# EasyEDA Pro project ProDocument_BFMC_Power Board V3_Final.epro

# Schematic Balance_batt_protection_SolidState_5

## Sheets
1 Balance_batt_protection_SolidState: Board Name: greater0603 Dsample; Create Date: 2024-08-29; Page Name: Balance_batt_protection_SolidState; Project Name: BFMC_Power Board V2; Schematic Name: Balance_batt_protection_SolidState_3; Update Date: 2024-08-30
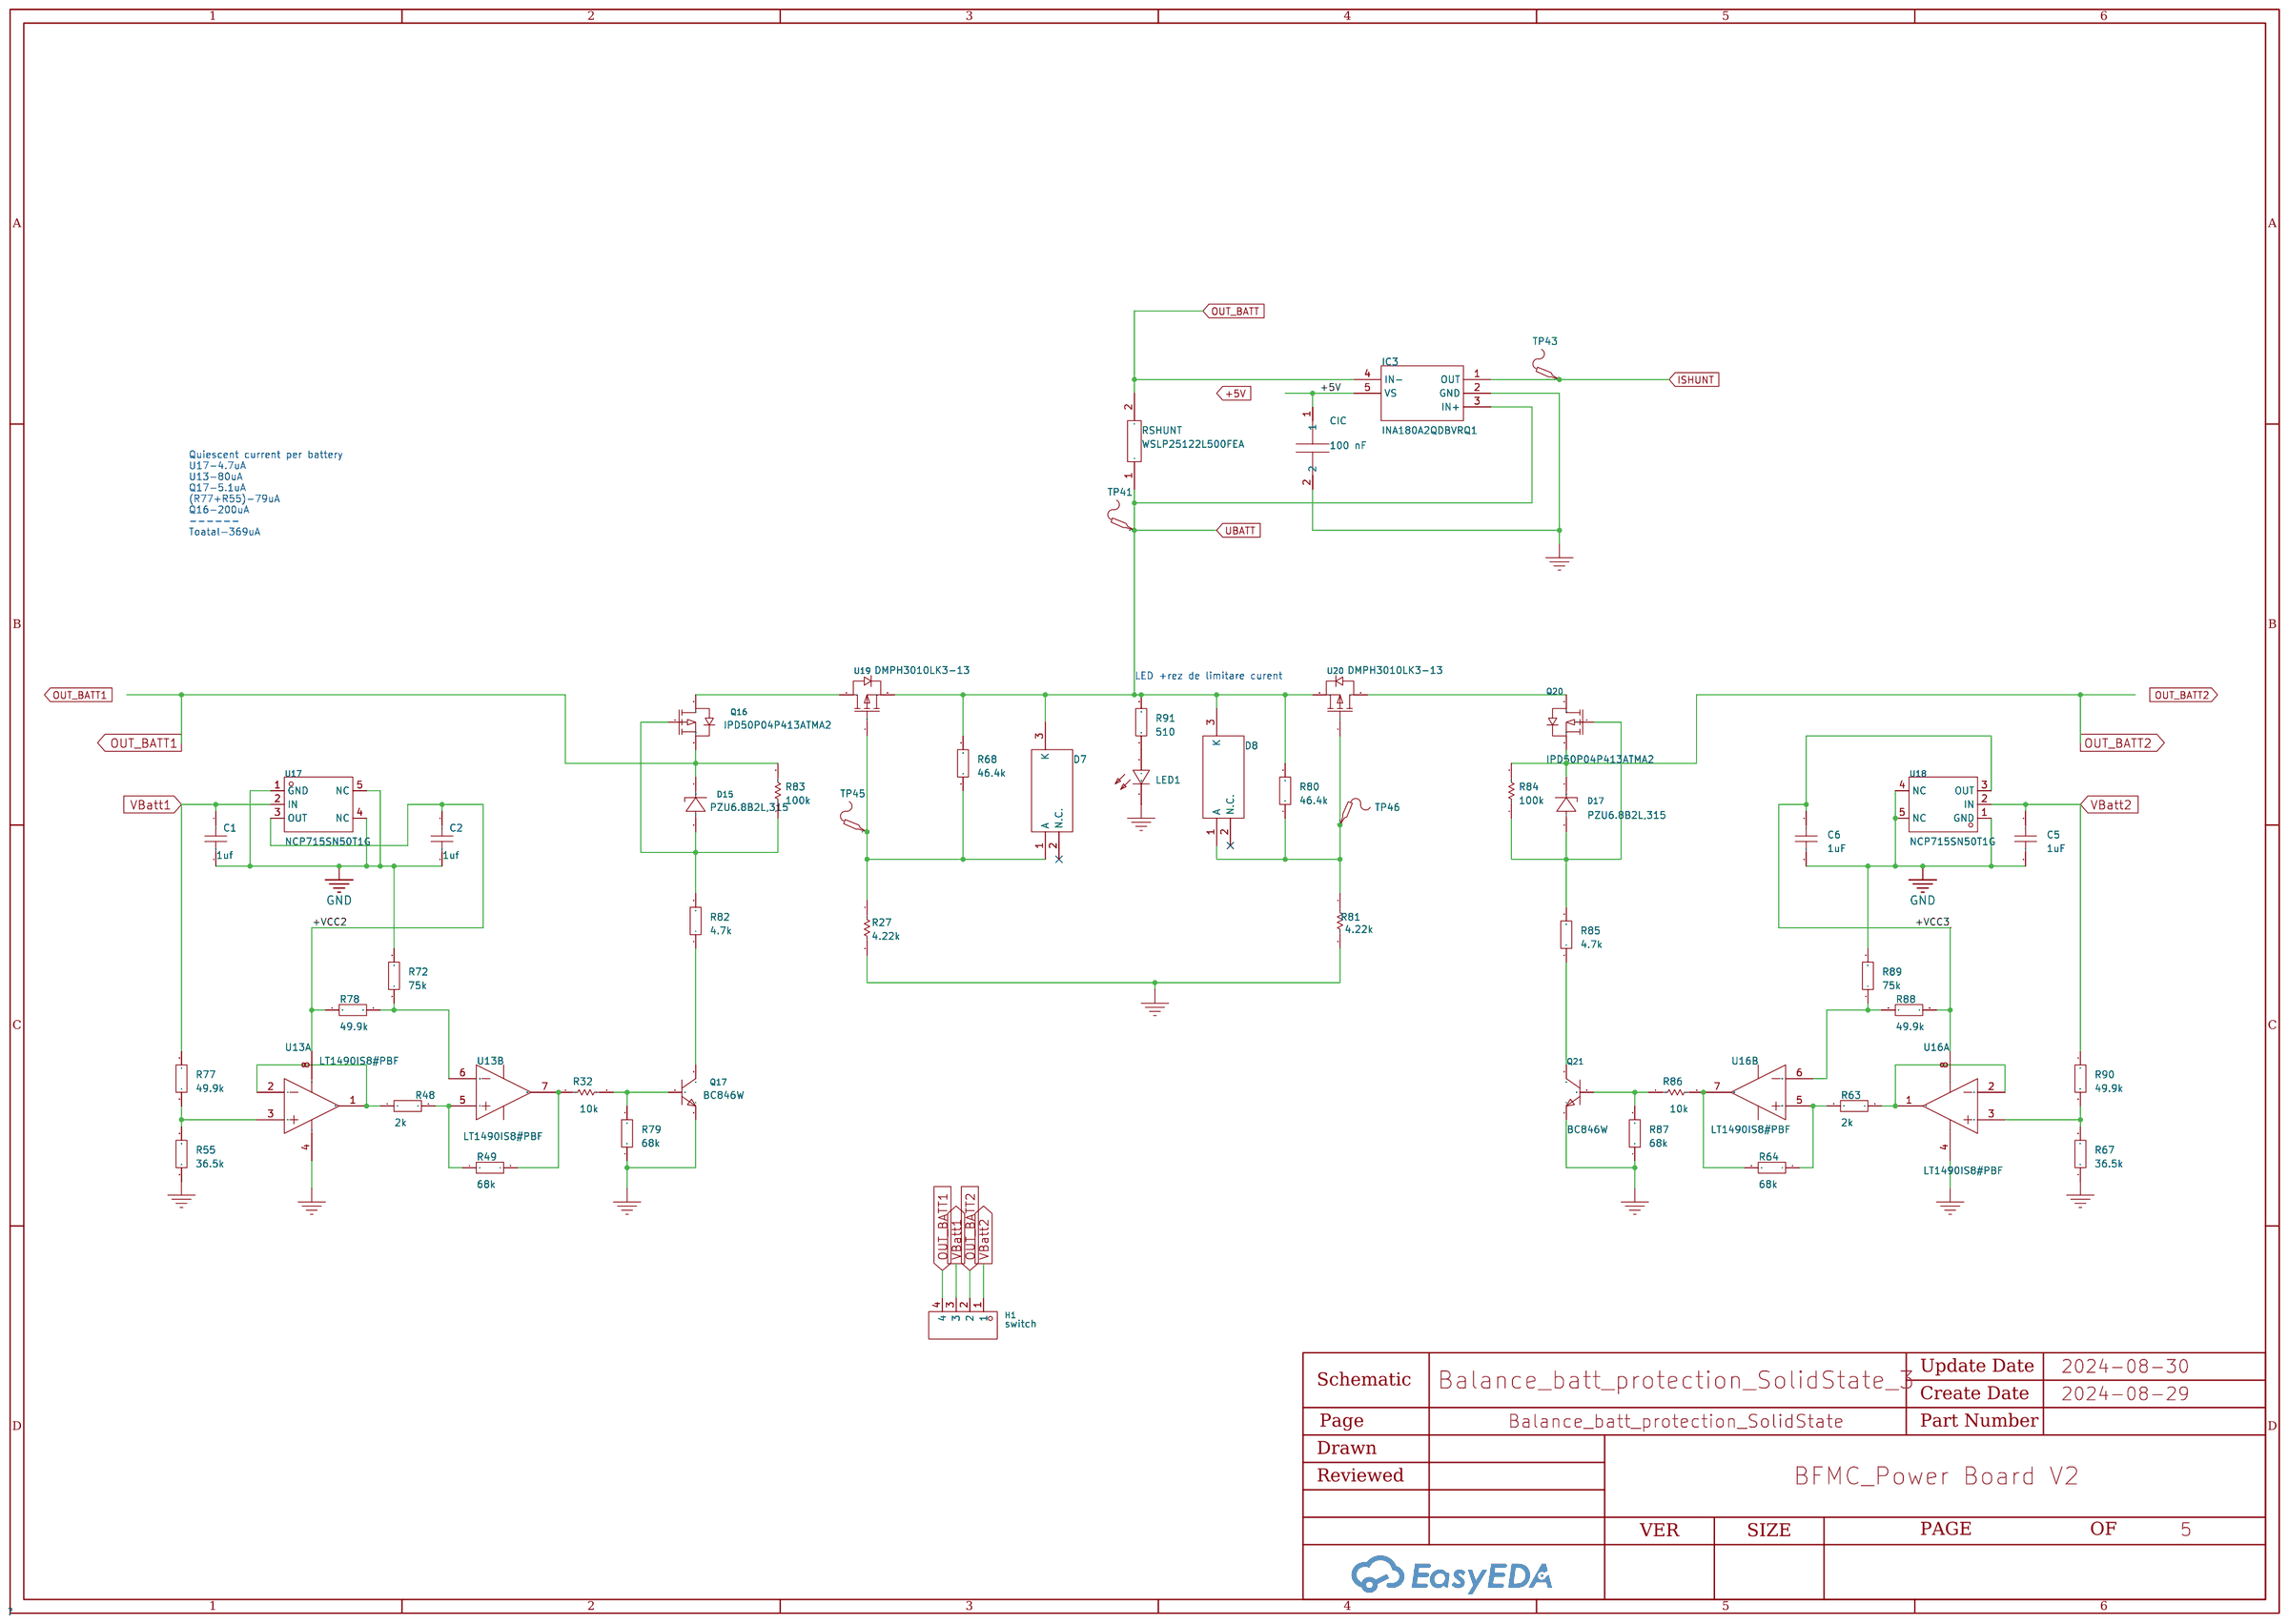
[diagram p0: Balance_batt_protection_SolidState]
2 PWR_Board: Page Name: PWR_Board
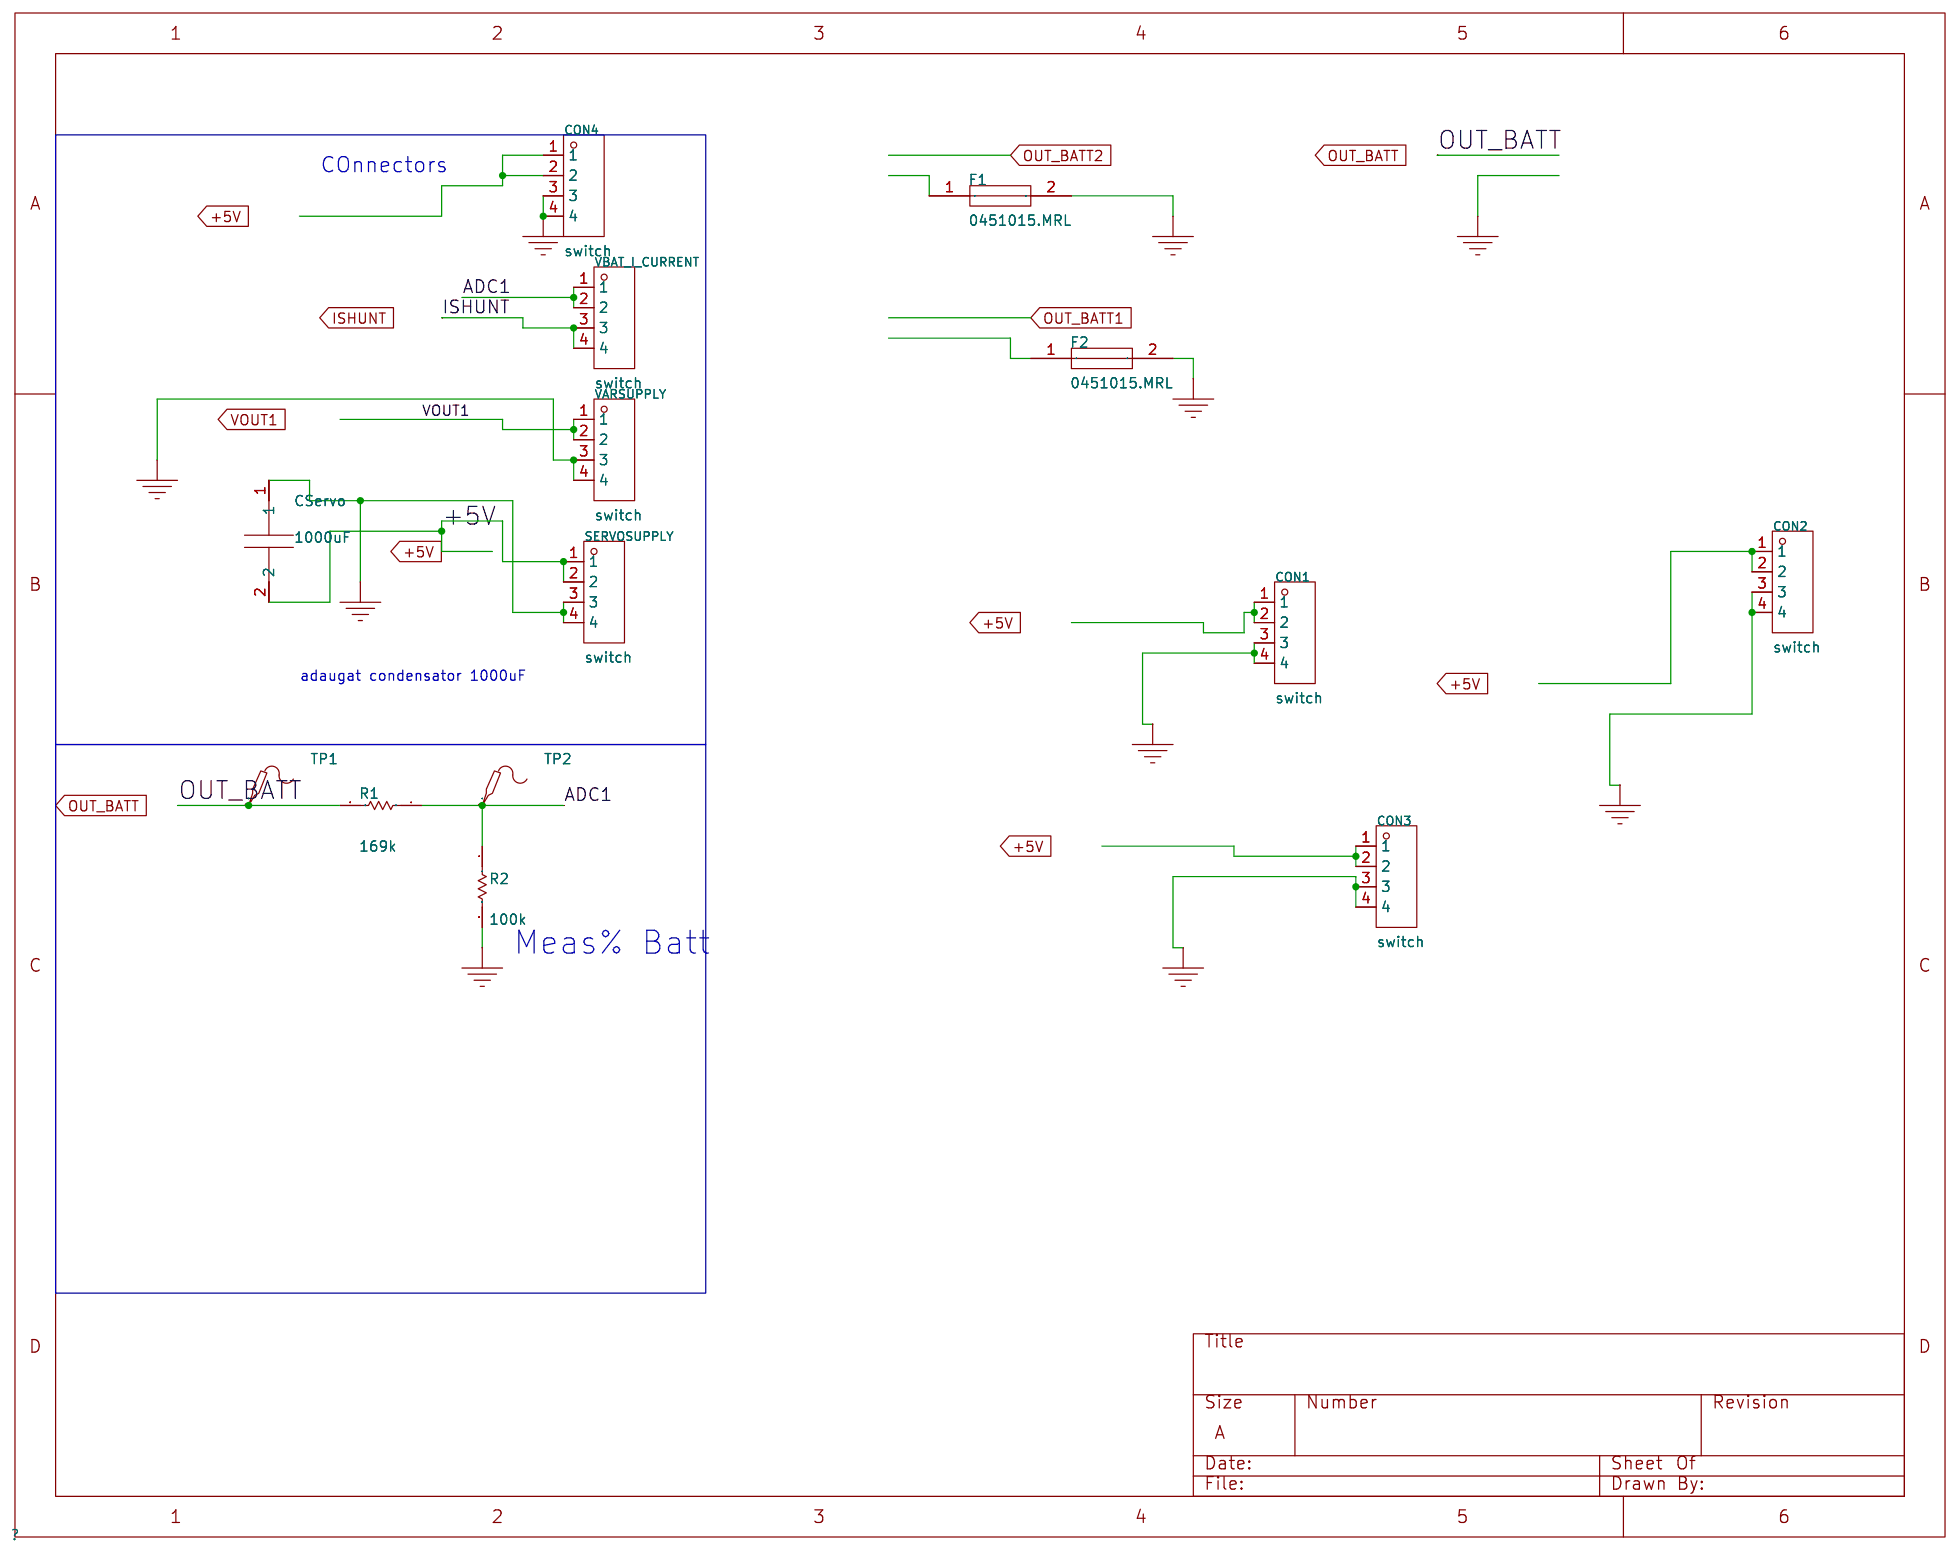
[diagram p1: PWR_Board]
3 bOOST cONVERTER
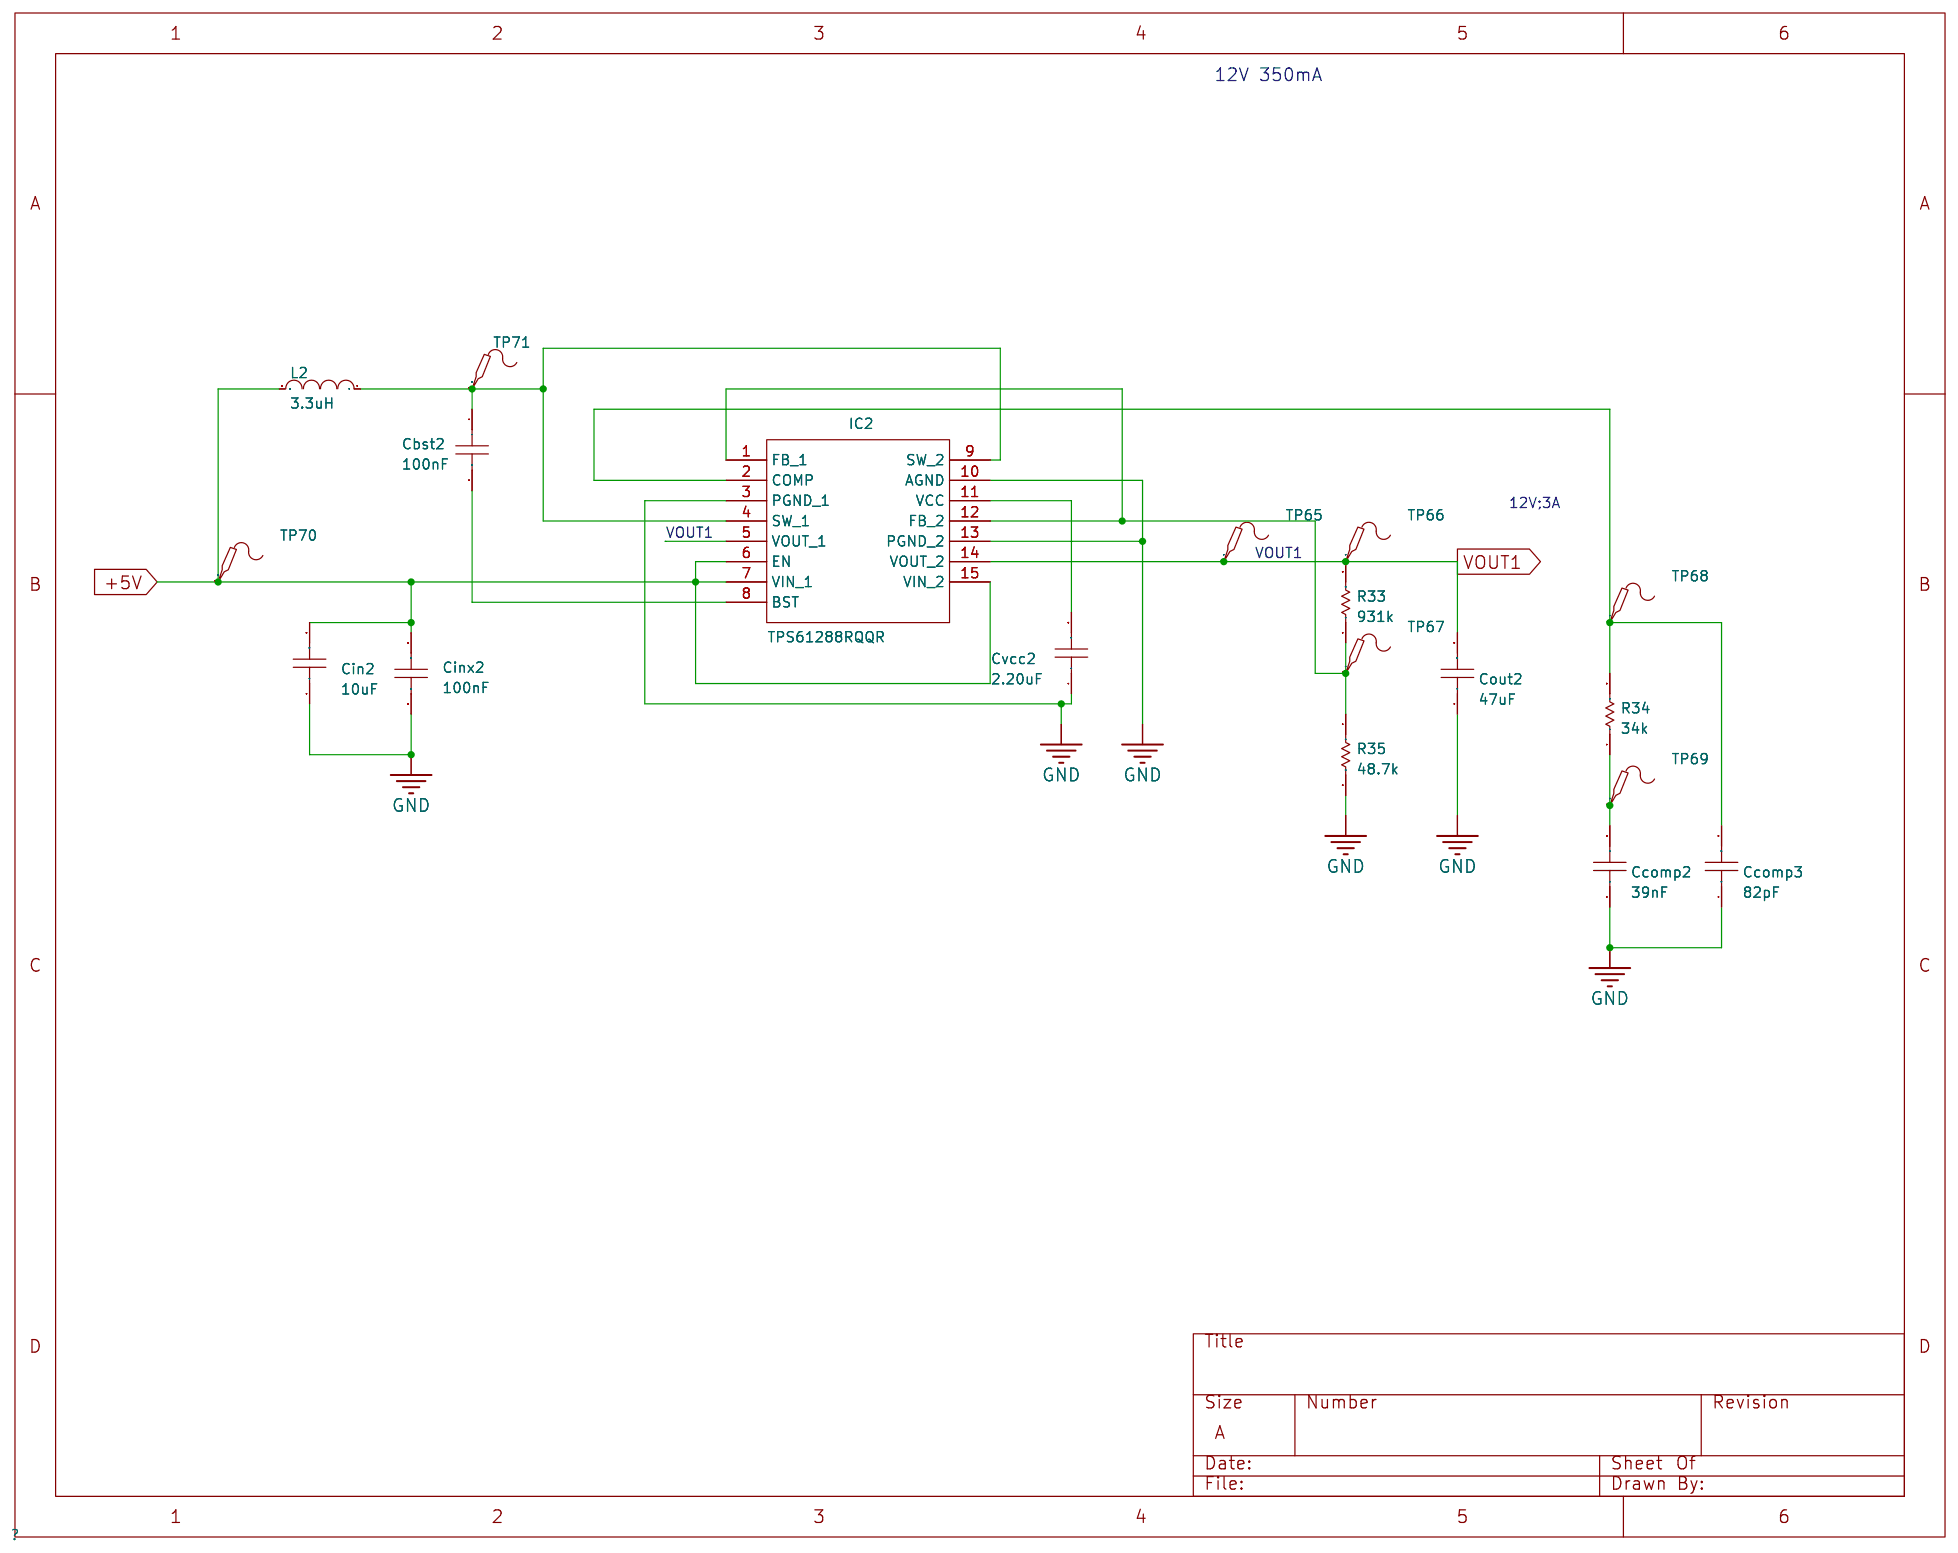
[diagram p2: bOOST cONVERTER]
4 buck_converter15A-5V: Page Name: buck_converter15A-5V; Update Date: 2024-08-29
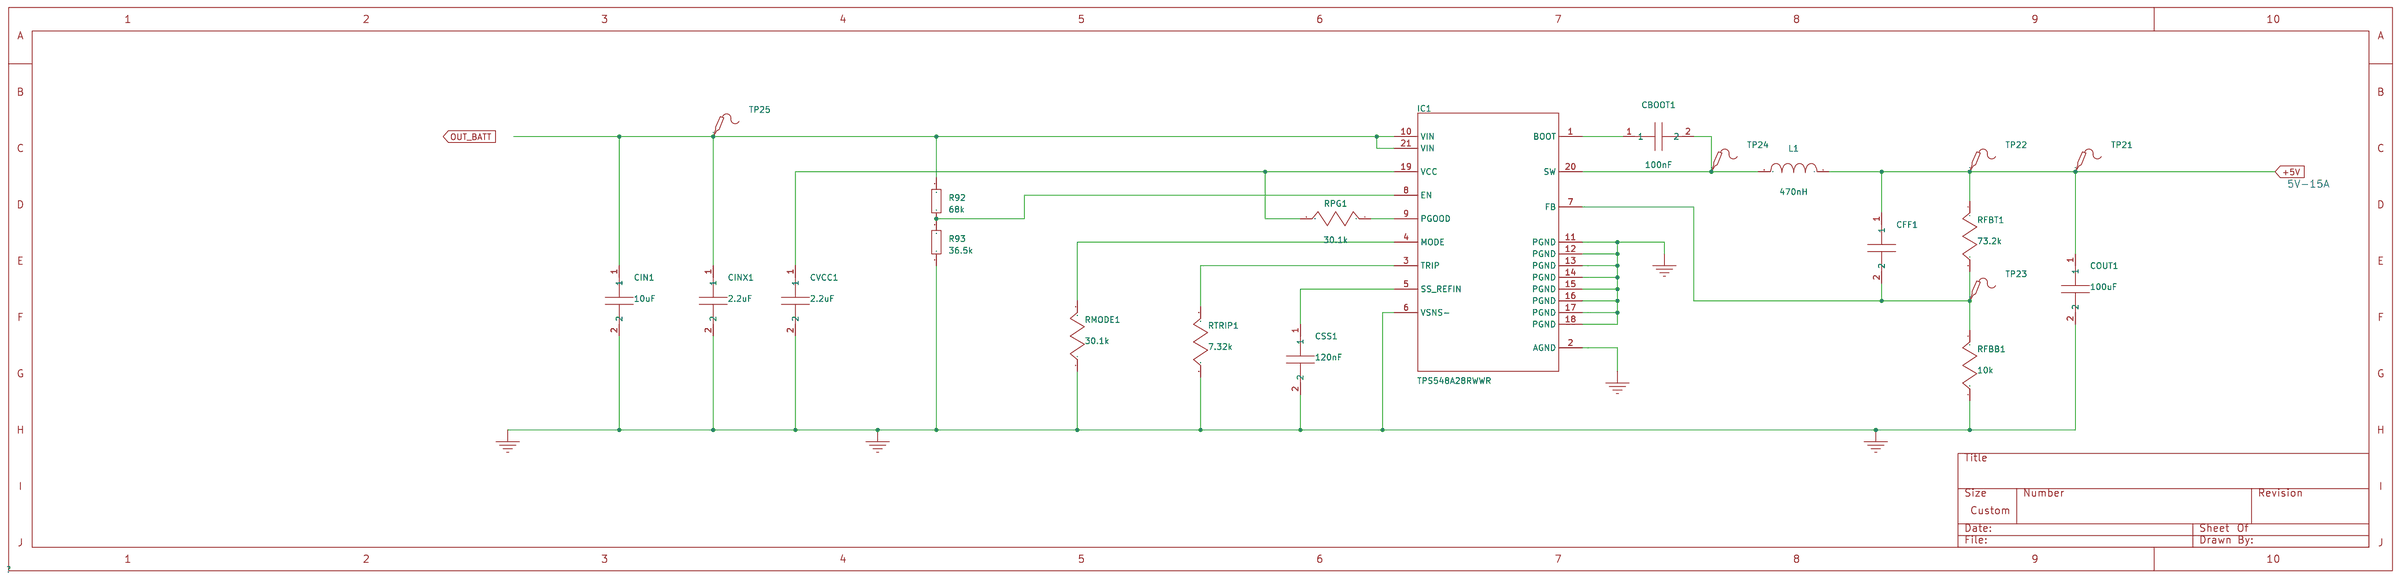
[diagram p3: buck_converter15A-5V]

## Parts
sheet Balance_batt_protection_SolidState
C1  1uf  [C9]
C2  1uf  [C9]
C5  1uF  [C9]
C6  1uF  [C9]
CIC  100 nF  [Cbst2]
D7  SZBZX84C18ET1G  [SZBZX84C18ET1G]
D8  SZBZX84C18ET1G  [SZBZX84C18ET1G]
D15  PZU6.8B2L,315  [DFN1006-2L-RD]
D17  PZU6.8B2L,315  [DFN1006-2L-RD]
H1  switch  [M2021BB1W01]
IC3  INA180A2QDBVRQ1  [INA180A2QDBVRQ1]
LED1  ASCKCG00-NW5X5020302  [LEDGREEN]
Q16  IPD50P04P413ATMA2  [PG-TO252-3_L6.3-W6.5-P4.57-LS10.0-BR-CW]
Q17  BC846W  [SOT-323-3_L2.2-W1.3-P1.30-LS2.2-BR]
Q20  IPD50P04P413ATMA2  [PG-TO252-3_L6.3-W6.5-P4.57-LS10.0-BR-CW]
Q21  BC846W  [SOT-323-3_L2.2-W1.3-P1.30-LS2.2-BR]
R27  4.22k  [R0805_NEW]
R32  10k  [R0603]
R48  2k  [R35]
R49  68k  [R0603]
R55  36.5k  [R0603]
R63  2k  [R35]
R64  68k  [R0603]
R67  36.5k  [R0603]
R68  46.4k  [R0603]
R72  75k  [R0603]
R77  49.9k  [R0603]
R78  49.9k  [R0603]
R79  68k  [R0603]
R80  46.4k  [R0603]
R81  4.22k  [R0805_NEW]
R82  4.7k  [R0603]
R83  100k  [R0603]
R84  100k  [R0603]
R85  4.7k  [R0603]
R86  10k  [R0603]
R87  68k  [R0603]
R88  49.9k  [R0603]
R89  75k  [R0603]
R90  49.9k  [R0603]
R91  510  [R0805_NEW]
RSHUNT  WSLP25122L500FEA  [WSLP25122L000FEA BUN]
TP41  -  [Test-Point-0.5mm]
TP43  -  [Test-Point-0.5mm]
TP45  -  [Test-Point-0.5mm]
TP46  -  [Test-Point-0.5mm]
U13  LT1490IS8#PBF  [SO-8_L4.9-W3.9-P1.27-LS5.9-BL]  (sections 1,2)
U16  LT1490IS8#PBF  [SO-8_L4.9-W3.9-P1.27-LS5.9-BL]  (sections 1,2)
U17  NCP715SN50T1G  [TSOP-5_L3.0-W1.5-P0.95-BL]
U18  NCP715SN50T1G  [TSOP-5_L3.0-W1.5-P0.95-BL]
U19  DMPH3010LK3-13  [PG-TO252-3_L6.3-W6.5-P4.57-LS10.0-BR-CW]
U20  DMPH3010LK3-13  [PG-TO252-3_L6.3-W6.5-P4.57-LS10.0-BR-CW]
sheet bOOST cONVERTER
Cbst2  100nF  [Cbst2]
Ccomp2  39nF  [0603 0.5x0.8]
Ccomp3  82pF  [Cbst2]
Cin2  10uF  [C0805]
Cinx2  100nF  [Cbst2]
Cout2  47uF  [C1210]
Cvcc2  2.20uF  [C0603]
IC2  TPS61288RQQR  [TPS61288RQQR]
L2  3.3uH  [DR127-3R3-R (L2)]
R33  931k  [R0603]
R34  34k  [R0603]
R35  48.7k  [R35]
TP65  -  [Test-Point-0.5mm]
TP66  -  [Test-Point-0.5mm]
TP67  -  [Test-Point-0.5mm]
TP68  -  [Test-Point-0.5mm]
TP69  -  [Test-Point-0.5mm]
TP70  -  [Test-Point-0.5mm]
TP71  -  [Test-Point-0.5mm]
sheet buck_converter15A-5V
CBOOT1  100nF  [Cbst2]
CFF1  C1005C0G1H220J  [0603 0.5x0.8]
CIN1  10uF  [Cin1 Aditome]
CINX1  2.2uF  [C0603]
COUT1  100uF  [C1210]
CSS1  120nF  [0603 0.5x0.8]
CVCC1  2.2uF  [C0603]
IC1  Value  [TPS548B28RWWR]
L1  470nH  [IHLP4040DZERR47M11]
R92  68k  [R0603]
R93  36.5k  [R0603]
RFBB1  10k  [0805 dany2]
RFBT1  73.2k  [0603 0.5x0.8]
RMODE1  30.1k  [1206R aditome]
RPG1  30.1k  [1206R aditome]
RTRIP1  7.32k  [Rtrip]
TP21  -  [Test-Point-0.5mm]
TP22  -  [Test-Point-0.5mm]
TP23  -  [Test-Point-0.5mm]
TP24  -  [Test-Point-0.5mm]
TP25  -  [Test-Point-0.5mm]
sheet PWR_Board
CON1  switch  [new connector]
CON2  switch  [new connector]
CON3  switch  [new connector]
CON4  switch  [new connector]
CServo  1000uF  [CAPAE1030X1050N]
F1  0451015.MRL  [FUSC6127X294N]
F2  0451015.MRL  [FUSC6127X294N]
R1  169k  [R0805_NEW]
R2  100k  [R0603]
SERVOSUPPLY  switch  [new connector]
TP1  -  [Test-Point-0.5mm]
TP2  -  [Test-Point-0.5mm]
VARSUPPLY  switch  [new connector]
VBAT_I_CURRENT  switch  [new connector]

## Library data of the parts
C1 C2 C5 C6 Cbst2 Ccomp2 Ccomp3 Cin2 Cinx2 Cout2 Cvcc2 = CAP_0201: Supplier Footprint: 0201
CIC = C2012X7S1C106K: C3216X6S1V106K16; PackageReference: C3216X6S1V106K160AC; Manufacturer Part Number: C3216X6S1V106K160AC; Manufacturer Name: TDK; Design Item ID: C3216X6S1V106K160AC; Library Name: TI WEBENCH
D7 D8 = SZBZX84C18ET1G: Zener Diode; Datasheet Link: https://assets.nexperia.com/documents/data-sheet/BZX84W_SER.pdf; Height: 1.1mm; Manufacturer_Name: Nexperia; Manufacturer_Part_Number: BZX84W-C15F; Mouser Part Number: 771-BZX84W-C15F; Mouser Price/Stock: https://www.mouser.co.uk/ProductDetail/Nexperia/BZX84W-C15F?qs=MLItCLRbWsyz6DhKLlcnOA%3D%3D; Arrow Part Number: BZX84W-C15F; Arrow Price/Stock: https://www.arrow.com/en/products/bzx84w-c15f/nexperia; Origin Footprint 2: SOT65P210X110-3N; Origin Footprint 3: SOT65P210X110-3N; Origin Footprint 1: SOT95P230X110-3N; Design Item ID: BZX84W-C15F; Library Name: BZX84(sot 23)
D15 D17 = PZU6.8B2L,315: Diode Configuration:Single Zener Voltage (Nom):6.8V Reverse Leakage Current (Ir):500nA@3.5V Zener Voltage (Range):6.65V~6.93V Zener Voltage (Range):6.65V~6.93V Power Dissipation:250mW Zener Impedance (Zzt):20Ω Tolerance:±2% Tolerance:±2%; Supplier Part: C553776; Manufacturer: Nexperia(安世); Supplier Footprint: DFN1006-2; JLCPCB Part Class: Extended Part; Datasheet: https://atta.szlcsc.com/upload/public/pdf/source/20200610/C553572_FAFAAE2347EA3EDE919A1362DDDB97BE.pdf; Supplier: LCSC; Diode Configuration: Single; Zener Voltage (Nom): 6.8V; Reverse Leakage Current (Ir): 500nA@3.5V; Zener Voltage (Range): 6.65V~6.93V; Power Dissipation: 250mW; Zener Impedance (Zzt): 20Ω; Tolerance: ±2%
CON1-CON4 H1 SERVOSUPPLY VARSUPPLY VBAT_I_CURRENT = HDR-F_2.54_1x4P: Supplier Footprint: Through
IC3 = INA180A2QDBVRQ1: Attenuator or Isolator; Datasheet Link: http://www.ti.com/lit/gpn/INA180-Q1; Height: 1.45mm; Manufacturer_Name: Texas Instruments; Mouser Part Number: 595-INA180A2QDBVRQ1; Mouser Price/Stock: https://www.mouser.co.uk/ProductDetail/Texas-Instruments/INA180A2QDBVRQ1?qs=9r4v7xj2LnnPs8OEye75UA%3D%3D; Arrow Price/Stock: https://www.arrow.com/en/products/ina180a2qdbvrq1/texas-instruments?region=nac; Origin Footprint 2: SOT95P280X145-5N; Origin Footprint 1: SOT95P280X145-5N
LED1 = 19-213/Y2C-CQ2R2L/3T(CY): Emitted Color:Yellow Power Dissipation:60mW Forward Current:20mA Dominant Wavelength:585.5nm~591.5nm Dominant Wavelength:585.5nm~591.5nm Peak Wavelength:591nm Diode Configuration:- Lens Color:无色透明透镜 Color Temperature:- Color Temperature:- Viewing Angle:12; LCSC Part Name: 黄灯; Supplier Part: C72038; Manufacturer: EVERLIGHT(亿光); Supplier Footprint: 0603; JLCPCB Part Class: Basic Part; Datasheet: https://atta.szlcsc.com/upload/public/pdf/source/20160507/1462613613586.pdf; Supplier: LCSC; Emitted Color: Yellow; Power Dissipation: 60mW; Forward Current: 20mA; Dominant Wavelength: 585.5nm~591.5nm; Peak Wavelength: 591nm; Lens Color: 无色透明透镜; Viewing Angle: 120°; Operating Temperature: -40℃~+85℃
Q16 Q20 = IPD50P04P4-13: Type: Drain Source Voltage (Vdss):- Continuous Drain Current (Id):- Power Dissipation (Pd):- Drain Source On Resistance (RDS(on)@Vgs,Id):- Gate Threshold Voltage (Vgs(th)@Id):- Total Gate Charge (Qg@Vgs):- Input Capacitance (Ciss@Vds):- Reverse Transfer C; Supplier Part: C536783; Manufacturer: Infineon(英飞凌); Supplier Footprint: TO-252-3; JLCPCB Part Class: Extended Part; Datasheet: https://atta.szlcsc.com/upload/public/pdf/source/20200522/C536783_09FA5EF647CCDC43F05EF5A053B0ED62.pdf; Supplier: LCSC
Q17 Q21 = BC846W: Supplier Part: C2885597; Manufacturer: CJ(江苏长电/长晶); Supplier Footprint: SOT-323-3; JLCPCB Part Class: Extended Part; Datasheet: https://atta.szlcsc.com/upload/public/pdf/source/20210816/C7091E37381F16E73D159A80C307E9BF.pdf; Supplier: LCSC
R27 R81 = MCR03..PFX1002: Resistor; Published: 8-Jun-2000; LatestRevisionDate: 17-Jul-2002; LatestRevisionNote: Re-released for DXP Platform.; PackageReference: AXIAL-0.3; Publisher: Altium Limited; PackageDescription: Axial Device, Thru-Hole; 2 Leads; 0.3 in Pin Spacing; Origin Footprint 2: AXIAL-0.3; Origin Footprint 1: ERJP06D1000V; Design Item ID: Res1; Library Name: Miscellaneous Devices
R32-R35 R83 R84 R86 = MCR03..PFX1002: Resistor; Published: 8-Jun-2000; LatestRevisionDate: 17-Jul-2002; LatestRevisionNote: Re-released for DXP Platform.; PackageReference: AXIAL-0.3; Publisher: Altium Limited; PackageDescription: Axial Device, Thru-Hole; 2 Leads; 0.3 in Pin Spacing; Origin Footprint 2: AXIAL-0.3; Origin Footprint 1: RESC1608X55N; Design Item ID: Res1; Library Name: Miscellaneous Devices
R48 R49 R55 R63 R64 R67 R68 R72 R77-R80 R82 R85 R87-R93 = Res_0603: Supplier Footprint: 0603
RSHUNT = WSLP25122L500FEA: Resistor; Datasheet Link: https://componentsearchengine.com/Datasheets/1/WSLP25122L500FEA.pdf; Height: 0.889mm; Manufacturer_Name: Vishay; Mouser Part Number: 71-WSLP25122L500FEA; Mouser Price/Stock: https://www.mouser.co.uk/ProductDetail/Vishay-Dale/WSLP25122L500FEA?qs=%2FCXICPRLKg%252BpcyljWM%2FHhA%3D%3D; Arrow Price/Stock: https://www.arrow.com/en/products/wslp25122l500fea/vishay; Origin Footprint 2: RESC6432X89N; Origin Footprint 1: RESC6432X89N; Library Name: WSLP25122L000FEA
TP1 TP2 TP21-TP25 TP41 TP43 TP45 TP46 TP65-TP71 = Test-Point: Test Point 测试点
U13 U16 = LT1490IS8#PBF: Number of Circuits:双路 Gain Bandwidth Product(GBP):200kHz Current - Input Bias(Ib):4nA Slew Rate(SR):0.07V/us Output Current:25mA -3db Bandwidth:- Output Type:- Rail to Rail:- Operating Temperature:-40℃~+85℃ Operating Temperature:-40℃~+85℃; Supplier Part: C664003; Manufacturer: ADI(亚德诺); Supplier Footprint: SO-8; JLCPCB Part Class: Extended Part; Datasheet: https://atta.szlcsc.com/upload/public/pdf/source/20200911/C663998_10A639210BD1A12FE99FCEB2BDE120AA.pdf; Supplier: LCSC; Number of Circuits: 双路; Gain Bandwidth Product(GBP): 200kHz; Current - Input Bias(Ib): 4nA; Slew Rate(SR): 0.07V/us; Output Current: 25mA; Operating Temperature: -40℃~+85℃
U17 U18 = NCP715SN50T1G: LCSC Part Name: LDO Regulator, 50 mA, Ultra-Low Iq; Supplier Part: C892746; Manufacturer: onsemi(安森美); Supplier Footprint: TSOP-5-1.5mm; JLCPCB Part Class: Extended Part; Datasheet: https://atta.szlcsc.com/upload/public/pdf/source/20210820/E9CE8331E60FC76A82F78D41C3EC7928.pdf; Supplier: LCSC
U19 U20 = DMPH3010LK3-13: Drain Source Voltage (Vdss): Drain Source On Resistance (RDS(on)@Vgs,Id):7.5mΩ Input Capacitance (Ciss@Vds):6807pF@15V; LCSC Part Name: 耐压:30V; Supplier Part: C5245399; Manufacturer: DIODES(美台); Supplier Footprint: TO-252(DPAK); Datasheet: https://atta.szlcsc.com/upload/public/pdf/source/20230810/7575F8349A3E3E974B58F51814AB80C1.pdf; Supplier: LCSC; Drain Source On Resistance (RDS(on)@Vgs,Id): 7.5mΩ; Input Capacitance (Ciss@Vds): 6807pF@15V
IC2 = TPS61288RQQR
L2 = L_0402: Supplier Footprint: L0402
CBOOT1 = EMK105 B7104KVHF: EMK107B7104KA-T; PackageReference: EMK107B7104KA-T; Manufacturer Part Number: EMK107B7104KA-T; Manufacturer Name: Taiyo Yuden; Design Item ID: EMK107B7104KA-T; Library Name: TI WEBENCH
CFF1 = C1005C0G1H220J: C0402C240J3GACTU; PackageReference: C0402C240J3GACTU; Manufacturer Part Number: C0402C240J3GACTU; Manufacturer Name: Kemet; C1005C0G1H220J: 22pF; Design Item ID: C0402C240J3GACTU; Library Name: TI WEBENCH
CIN1 = GCJ31CC71E106K: GRM31CR71E106KA1; PackageReference: GRM31CR71E106KA12L; Manufacturer Part Number: GRM31CR71E106KA12L; Manufacturer Name: MuRata; Design Item ID: GRM31CR71E106KA12L; Library Name: TI WEBENCH
CINX1 CServo = GCM188C71A225K: C1608X7R1A225K08; PackageReference: C1608X7R1A225K080AC; Manufacturer Part Number: C1608X7R1A225K080AC; Manufacturer Name: TDK; Design Item ID: C1608X7R1A225K080AC; Library Name: TI WEBENCH
COUT1 = EMK325ABJ107MM-T: CUSTOM1; PackageReference: CUSTOM; Manufacturer Part Number: GENERIC_CAPACITOR; Manufacturer Name: CUSTOM; Design Item ID: GENERIC_CAPACITOR; Library Name: TI WEBENCH
CSS1 = C1608X7R1H154K: GRM155R61A124KE1; PackageReference: GRM155R61A124KE19D; Manufacturer Part Number: GRM155R61A124KE19D; Manufacturer Name: MuRata; Design Item ID: GRM155R61A124KE19D; Library Name: TI WEBENCH
CVCC1 = GCM188C71A225K: GRM188R71A225KE1; PackageReference: GRM188R71A225KE15D; Manufacturer Part Number: GRM188R71A225KE15D; Manufacturer Name: MuRata; Design Item ID: GRM188R71A225KE15D; Library Name: TI WEBENCH
IC1 = TPS548A28RWWR: No Description Available; Manufacturer: Texas Instruments; TYPE: TYPE; Manufacturer_Name: Texas Instruments; Copyright: Copyright (C) 2018 Accelerated Designs. All rights reserved; Library Name: TPS548B(vqfn-hr-21)
L1 = IHLP4040DZERR47M11: IHLP4040DZERR47M; Manufacturer Name: Vishay-Dale; Origin Footprint 2: INDPM108102X400N; Library Name: TI WEBENCH
RFBB1 = SMM0204 50 10K 1 %: CRCW040210K0FKED; PackageReference: CRCW040210K0FKED; Manufacturer Part Number: CRCW040210K0FKED; Manufacturer Name: Vishay-Dale; Design Item ID: CRCW040210K0FKED; Library Name: TI WEBENCH
RFBT1 = SMM0204 50 73K2 1 %: CRCW040273K2FKED; PackageReference: CRCW040273K2FKED; Manufacturer Part Number: CRCW040273K2FKED; Manufacturer Name: Vishay-Dale; Design Item ID: CRCW040273K2FKED; Library Name: TI WEBENCH
RMODE1 RPG1 = SMM0204 50 30K1 1 %: CRCW040230K1FKED; PackageReference: CRCW040230K1FKED; Manufacturer Part Number: CRCW040230K1FKED; Manufacturer Name: Vishay-Dale; Design Item ID: CRCW040230K1FKED; Library Name: TI WEBENCH
RTRIP1 = SMM0204 50 7K32 1 %: PackageReference: CRCW04027K32FKED; Manufacturer Part Number: CRCW04027K32FKED; Manufacturer Name: Vishay-Dale; Design Item ID: CRCW04027K32FKED; Library Name: TI WEBENCH
F1 F2 = 0451015.MRL: Fuse; Datasheet Link: http://www.littelfuse.com/~/media/electronics/datasheets/fuses/littelfuse_fuse_451_453_datasheet.pdf.pdf; Height: 2.94mm; Manufacturer_Name: LITTELFUSE; Mouser Part Number: 576-0451015.MRL; Mouser Price/Stock: https://www.mouser.co.uk/ProductDetail/Littelfuse/0451015.MRL?qs=bpnLQM2ZShzZ87Rm5CvzLA%3D%3D; Arrow Price/Stock: https://www.arrow.com/en/products/0451015.mrl/littelfuse?region=europe; Library Name: 0451015.MRL(6.1x2.69)
R1 = MCR03..PFX1051: Resistor; Published: 8-Jun-2000; LatestRevisionDate: 17-Jul-2002; LatestRevisionNote: Re-released for DXP Platform.; PackageReference: AXIAL-0.3; Publisher: Altium Limited; PackageDescription: Axial Device, Thru-Hole; 2 Leads; 0.3 in Pin Spacing; Origin Footprint 2: AXIAL-0.3; Origin Footprint 1: RESC1608X55N; Design Item ID: Res1; Library Name: Miscellaneous Devices
R2 = MCR03...PFX7680: Resistor; Published: 8-Jun-2000; LatestRevisionDate: 17-Jul-2002; LatestRevisionNote: Re-released for DXP Platform.; PackageReference: AXIAL-0.3; Publisher: Altium Limited; PackageDescription: Axial Device, Thru-Hole; 2 Leads; 0.3 in Pin Spacing; Origin Footprint 2: AXIAL-0.3; Origin Footprint 1: RESC1608X55N; Design Item ID: Res1; Library Name: Miscellaneous Devices

## Nets
+5V: CFF1.1 CIC.1 Cin2.2 Cinx2.1 CON1.1 CON1.2 CON2.1 CON2.2 CON3.1 CON3.2 CON4.1 CON4.2 COUT1.1 CServo.2 IC2.6(EN) IC2.7(VIN_1) IC2.15(VIN_2) IC3.5(VS) L1.1 L2.2 RFBT1.1 SERVOSUPPLY.1 SERVOSUPPLY.2 TP21.1 TP22.1 TP70.1
+VCC2: C2.1 R78.2 U13.8(V+) U17.3(OUT)
+VCC3: C6.1 R88.1 U16.8(V+) U18.3(OUT)
GND: C1.2 C2.2 C5.2 C6.2 Ccomp2.1 Ccomp3.1 CIC.2 CIN1.2 Cin2.1 CINX1.2 Cinx2.2 CON1.3 CON1.4 CON2.3 CON2.4 CON3.3 CON3.4 CON4.3 CON4.4 COUT1.2 Cout2.1 CServo.1 CSS1.2 CVCC1.2 Cvcc2.1 F1.2 F2.2 IC1.2(AGND) IC1.6(VSNS-) IC1.11(PGND) IC1.12(PGND) IC1.13(PGND) IC1.14(PGND) IC1.15(PGND) IC1.16(PGND) IC1.17(PGND) IC1.18(PGND) IC2.3(PGND_1) IC2.10(AGND) IC2.13(PGND_2) IC3.2(GND) LED1.1(C) Q17.2(E) Q21.2(E) R2.2 R27.2 R35.2 R55.1 R67.1 R72.2 R79.1 R81.2 R87.1 R89.2 R93.1 RFBB1.2 RMODE1.2 RTRIP1.2 SERVOSUPPLY.3 SERVOSUPPLY.4 U13.4(V-) U16.4(V-) U17.1(GND) U17.4(NC) U17.5(NC) U18.1(GND) U18.4(NC) U18.5(NC) VARSUPPLY.3 VARSUPPLY.4
VBatt1: C1.1 H1.3 R77.2 U17.2(IN)
VBatt2: C5.1 H1.1 R90.1 U18.2(IN)
VCC: CVCC1.1 IC1.19(VCC) RPG1.2
VCCBOOST: Cvcc2.2 IC2.11(VCC)
ADC1: R1.1 R2.1 TP2.1 VBAT_I_CURRENT.1 VBAT_I_CURRENT.2
BOOT: CBOOT1.1 IC1.1(BOOT)
BST: Cbst2.2 IC2.8(BST)
COMP: Ccomp3.2 IC2.2(COMP) R34.2 TP68.1
EN: IC1.8(EN) R92.1 R93.2
FB: CFF1.2 IC1.7(FB) RFBB1.1 RFBT1.2 TP23.1
FB_1: IC2.1(FB) IC2.12(FB_2) R33.1 R35.1 TP67.1
ISHUNT: IC3.1(OUT) TP43.1 VBAT_I_CURRENT.3 VBAT_I_CURRENT.4
MODE: IC1.4(MODE) RMODE1.1
OUT_BATT: CIN1.1 CINX1.1 IC1.10(VIN) IC1.21(VIN) IC3.4(IN-) R1.2 R92.2 RSHUNT.2 TP1.1 TP25.1
OUT_BATT1: D15.1(C) H1.4 Q16.3(S) R83.2
OUT_BATT2: D17.1(C) H1.2 Q20.3(S) R84.2
PGOOD: IC1.9(PGOOD) RPG1.1
SS_REFIN: CSS1.1 IC1.5(SS_REFIN)
SW: CBOOT1.2 IC1.20(SW) L1.2 TP24.1
SW_1: Cbst2.1 IC2.4(SW_1) IC2.9(SW_2) L2.1 TP71.1
TRIP: IC1.3(TRIP) RTRIP1.1
UBATT: D7.3(K) D8.3(K) IC3.3(IN+) R68.2 R80.2 R91.2 RSHUNT.1 TP41.1 U19.3(S) U20.3(S)
VOUT1: Cout2.2 IC2.5(VOUT_1) IC2.14(VOUT_2) R33.2 TP65.1 TP66.1 VARSUPPLY.1 VARSUPPLY.2
$1N1788: D8.1(A) R80.1 R81.1 TP46.1 U20.1(G)
$1N1798: D7.1(A) R27.1 R68.1 TP45.1 U19.1(G)
$1N2164: Q16.2(D) U19.2(D)
$1N2337: D15.2(A) Q16.1(G) R82.2 R83.1
$1N2412: Q17.3(C) R82.1
$1N2516: Q17.1(B) R32.2 R79.2
$1N20674: R55.2 R77.1 U13.3(+IN)
$1N20931: R48.1 U13.1(OUT) U13.2(-IN)
$1N20946: R48.2 R49.1 U13.5(+IN B)
$1N20962: R32.1 R49.2 U13.7(OUT B)
$1N21052: R72.1 R78.1 U13.6(-IN B)
$1N27791: Q20.2(D) U20.2(D)
$1N27792: D17.2(A) Q20.1(G) R84.1 R85.2
$1N27793: Q21.3(C) R85.1
$1N27799: Q21.1(B) R86.1 R87.2
$1N27802: R63.1 U16.1(OUT) U16.2(-IN)
$1N27807: R63.2 R64.1 U16.5(+IN B)
$1N27811: R64.2 R86.2 U16.7(OUT B)
$1N27822: R67.2 R90.2 U16.3(+IN)
$1N32332: R88.2 R89.1 U16.6(-IN B)
$1N40141: LED1.2(A) R91.1
$3N2936: Ccomp2.2 R34.1 TP69.1

Not connected (* = marked no-connect by the designer): D7 2(N.C.)*; D8 2(N.C.)*; F1 1; F2 1

## Notes on the sheets
sheet 1
- Quiescent current per battery
  U17-4.7uA
  U13-80uA
  Q17-5.1uA
  (R77+R55)-79uA
  Q16-200uA
  ------
  Toatal-369uA
- LED +rez de limitare curent
sheet 2
- COnnectors
- adaugat condensator 1000uF
- Meas% Batt
sheet 3
- 12V 350mA
- 12V;3A
sheet 4
- 5V-15A

# Board BFMC_2024.pcb
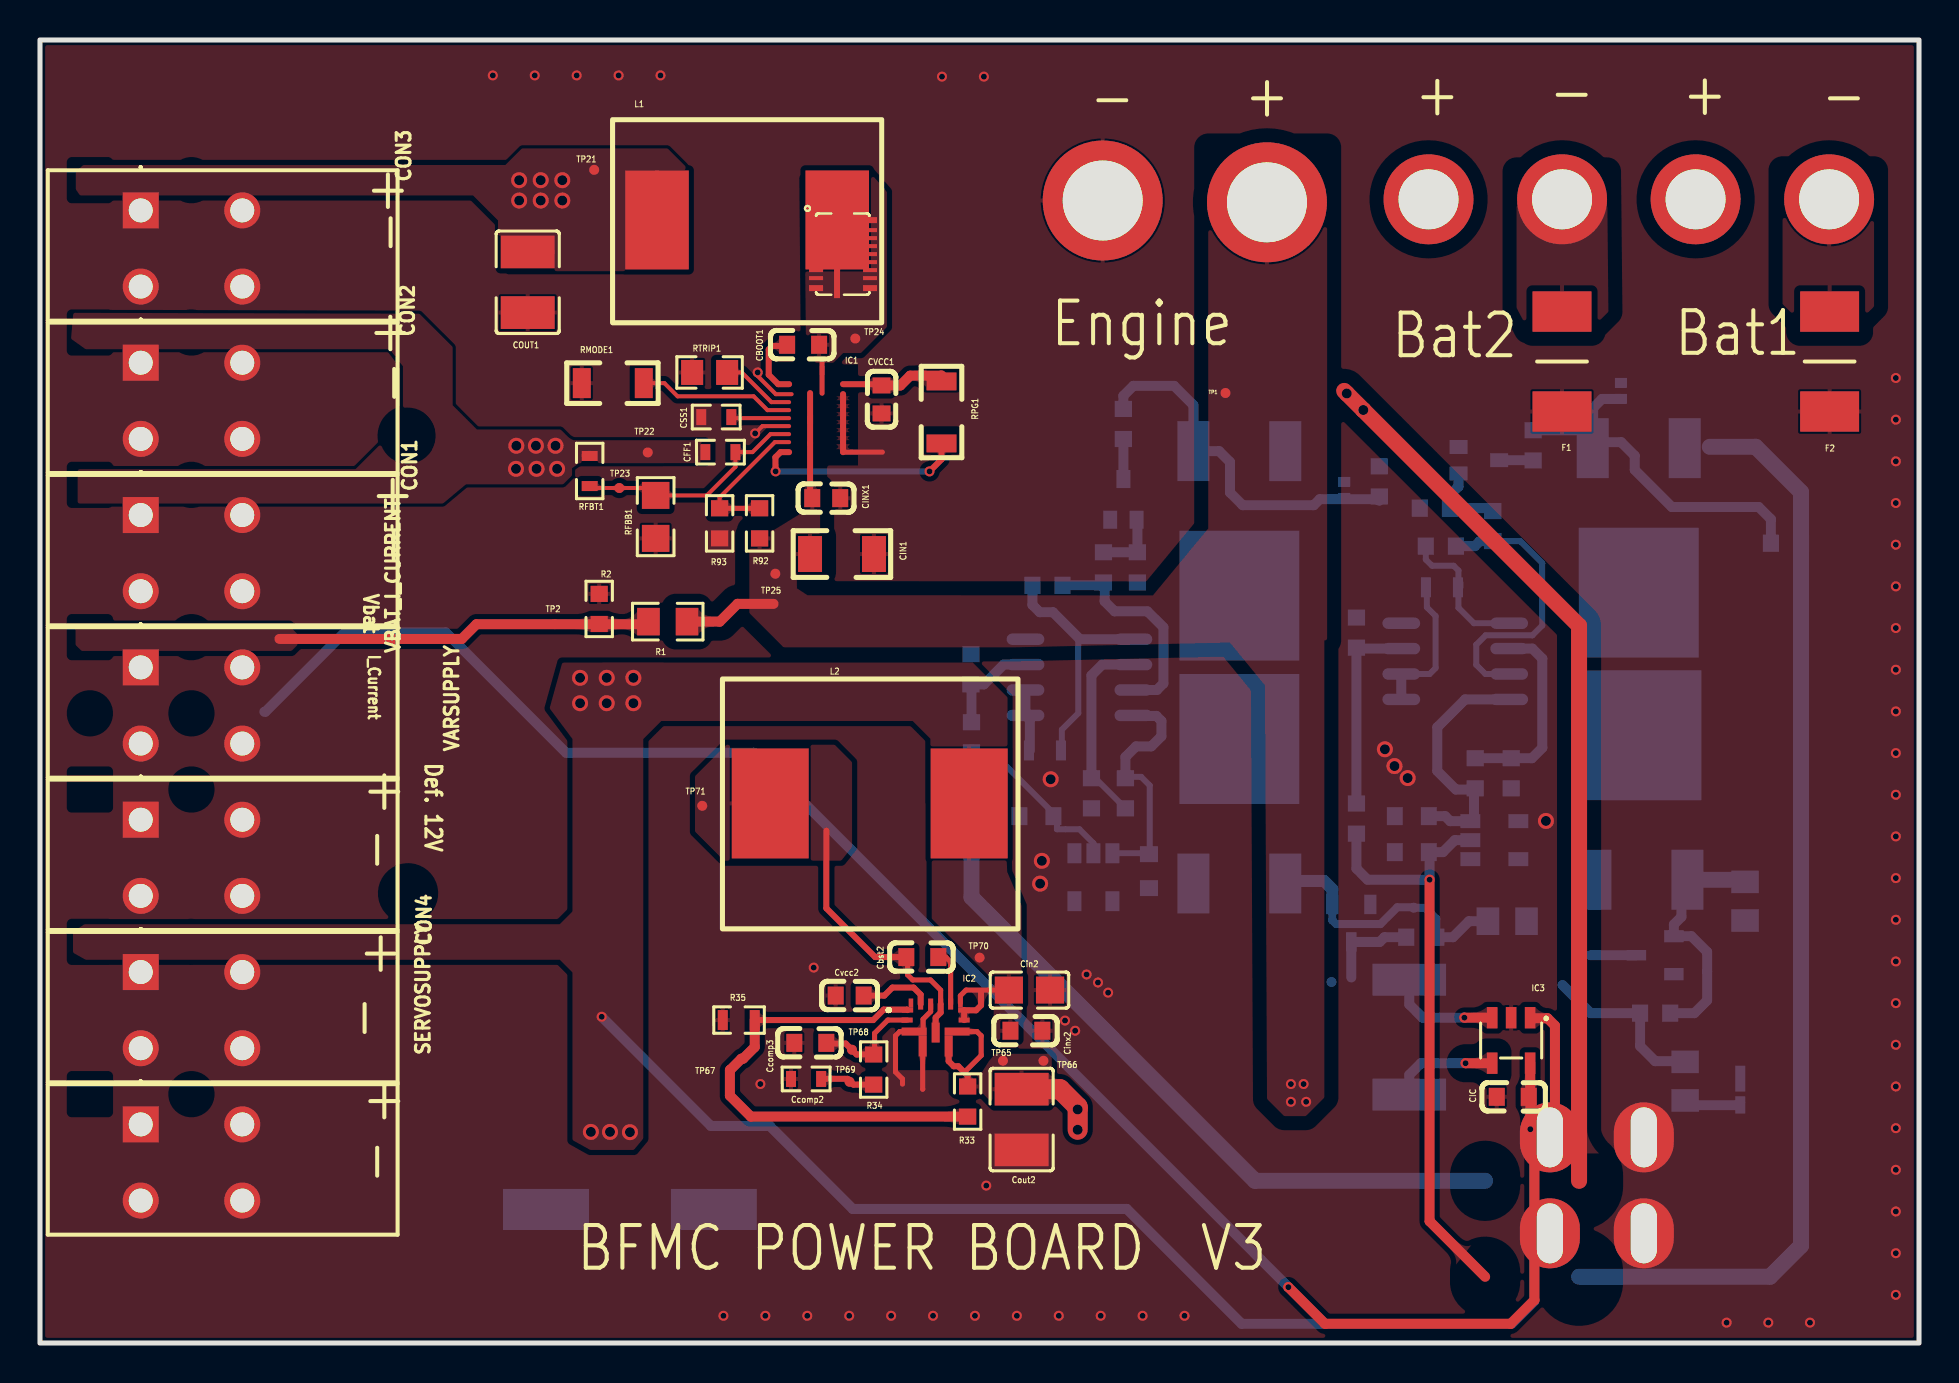
[diagram p4: board, top side]
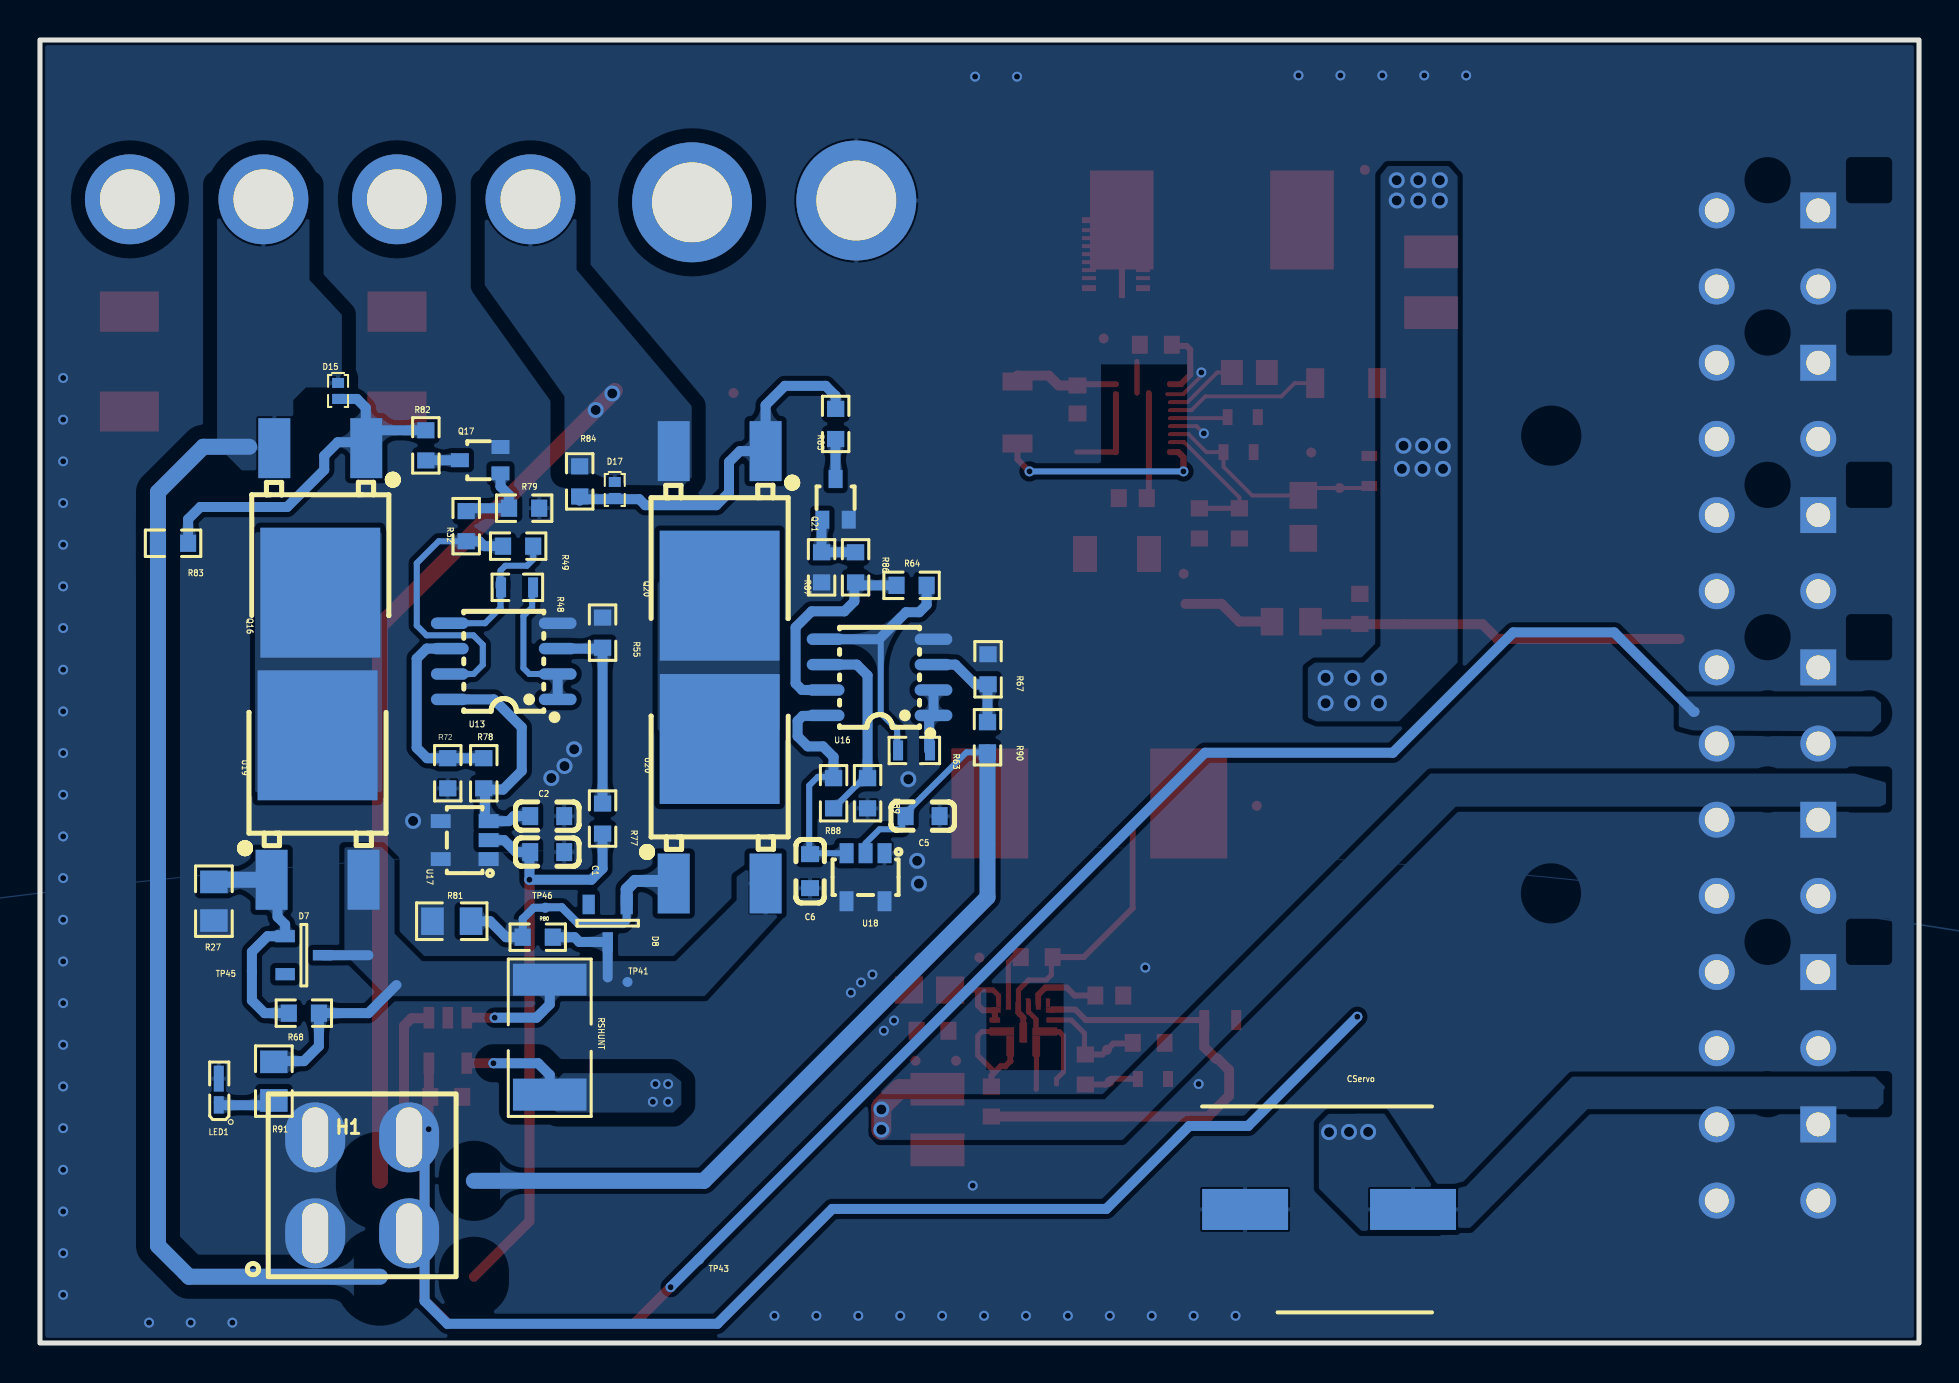
[diagram p5: board, bottom side, seen from below]

Outline 94 x 65.18 mm; copper layers: Top Layer, Bottom Layer. Coordinates in mm from the lower left corner of the outline.
Outline path: rectangle 0,65.18 94,0
Stack: Top Layer 0.035mm - / Dielectric1 1.51mm FR4 er 4.5 / Bottom Layer 0.035mm -

## Design rules (mm)
template: Custom Config
spacing copperThickness1oz (default): track to track 0.102, other pairs 0.152 to 0.3
spacing copperThickness2oz: track to track 0.203, other pairs 0.152 to 0.3
spacing Supply-GND: track to track 0.5, other pairs 0.5 to 0.5
track width copperThickness1oz (default): min 0.127, default 0.254, max 2.54
track width copperThickness2oz: min 0.203, default 0.254, max 2.54
differential pair differentialPair (default): width min 0.127, default 0.254, max 2.54; gap min 0.152, default 0.152
via viaSize (default): diameter min 0.5, default 0.61, max 10; hole min 0.3, default 0.305, max 6.3
['net', 'out batt'] ['NET', 'GND'] uses Supply-GND
['net', 'out batt1'] ['NET', 'GND'] uses Supply-GND
['net', 'out batt2'] ['NET', 'GND'] uses Supply-GND
['net', 'out batt2'] ['NET', '$2N28'] uses Supply-GND
['net', 'out batt1'] ['NET', '$2N30'] uses Supply-GND
['net', 'out batt'] ['NET', 'GND'] uses copperRegion2
['net', 'out batt1'] ['NET', 'GND'] uses copperRegion2
['net', 'out batt2'] ['NET', 'GND'] uses copperRegion2
['net', '$2n28'] ['NET', 'GND'] uses copperRegion2
['net', '$2n30'] ['NET', 'GND'] uses copperRegion2

## Placement (name value [footprint] x y rotation side)
C1  1uf  [c9]  68.68 24.56 180 bottom
C2  1uf  [c9]  68.68 26.36 180 bottom
C5  1uF  [c9]  49.9 26.36 180 bottom
C6  1uF  [c9]  55.48 23.66 270 bottom
CBOOT1  100nF  [cbst2]  38.08 49.94 0 top
Cbst2  100nF  [Cbst2]  44.04 19.31 0 top
Ccomp2  39nF  [0603 0.5x0.8]  38.32 13.21 0 top
Ccomp3  82pF  [cbst2]  38.44 15.02 0 top
CFF1  C1005C0G1H220J  [0603 0.5x0.8]  34.04 44.56 0 top
CIC  100 nF  [cbst2]  73.78 12.31 180 top
CIN1  10uF  [cin1 aditome]  40.22 39.47 0 top
Cin2  10uF  [c0805]  49.5 17.65 180 top
CINX1  2.2uF  [c0603]  39.33 42.26 0 top
Cinx2  100nF  [cbst2]  49.25 15.62 0 top
CON1  switch  [new connector]  5.04 41.02 270 top
CON2  switch  [new connector]  5.04 48.64 270 top
CON3  switch  [new connector]  5.04 56.26 270 top
CON4  switch  [new connector]  5.04 18.16 270 top
COUT1  100uF  [c1210]  24.4 53.06 270 top
Cout2  47uF  [c1210]  49.11 11.18 90 top
CServo  1000uF  [capae1030x1050n]  29.51 6.68 180 bottom
CSS1  120nF  [0603 0.5x0.8]  33.83 46.32 180 top
CVCC1  2.2uF  [c0603]  42.1 47.2 270 top
Cvcc2  2.20uF  [c0603]  40.51 17.38 0 top
D7  SZBZX84C18ET1G  [szbzx84c18et1g]  80.8 19.4 270 bottom
D8  SZBZX84C18ET1G  [szbzx84c18et1g]  65.6 21 0 bottom
D15  PZU6.8B2L,315  [dfn1006-2l-rd]  79.09 47.62 270 bottom
D17  PZU6.8B2L,315  [dfn1006-2l-rd]  65.25 42.67 270 bottom
F1  0451015.MRL  [fusc6127x294n]  76.14 49.1 270 top
F2  0451015.MRL  [fusc6127x294n]  89.53 49.1 270 top
H1  switch  [M2021BB1W01]  74.64 5.72 0 bottom
IC1  Value  [TPS548B28RWWR]  38.82 46.26 0 top
IC2  -  [TPS61288RQQR]  44.81 15.78 0 top
IC3  INA180A2QDBVRQ1  [ina180a2qdbvrq1]  73.6 15.14 180 top
L1  470nH  [ihlp4040dzerr47m11]  35.38 56.11 0 top
L2  3.3uH  [dr127-3r3-r (l2)]  41.51 26.99 0 top
LED1  ASCKCG00-NW5X5020302  [ledgreen]  85.06 12.67 90 bottom
NOREF  -  [Pad_e148]  82.82 57.21 0 top
NOREF#2  -  [Pad_e149]  89.5 57.21 0 top
NOREF#3  -  [Pad_e151]  76.14 57.21 0 top
NOREF#4  -  [Pad_e146]  61.38 57.06 0 top
NOREF#5  -  [Pad_e147]  53.16 57.15 0 top
NOREF#6  -  [Pad_e107]  69.46 57.21 0 top
Q16  IPD50P04P413ATMA2  [PG-TO252-3_L6.3-W6.5-P4.57-LS10.0-BR-CW]  79.98 41.15 90 bottom
Q17  BC846W  [sot-323-3_l2.2-w1.3-p1.30-ls2.2-br]  71.98 44.16 180 bottom
Q20  IPD50P04P413ATMA2  [PG-TO252-3_L6.3-W6.5-P4.57-LS10.0-BR-CW]  60 41 90 bottom
Q21  BC846W  [sot-323-3_l2.2-w1.3-p1.30-ls2.2-br]  54.2 42.2 270 bottom
R1  169k  [R0805_NEW]  31.4 36.08 0 top
R2  100k  [R0603]  27.97 36.72 90 top
R27  4.22k  [r0805_new]  85.3 22.1 270 bottom
R32  10k  [R0603]  72.68 40.86 90 bottom
R33  931k  [r0603]  46.41 12.08 90 top
R34  34k  [R0603]  41.71 13.68 90 top
R35  48.7k  [r35]  34.96 16.16 180 top
R48  2k  [R35]  70.18 37.8 0 bottom
R49  68k  [R0603]  70.08 39.86 0 bottom
R55  36.5k  [r0603]  65.86 35.53 270 bottom
R63  2k  [R35]  50.32 29.64 0 bottom
R64  68k  [R0603]  50.4 37.9 0 bottom
R67  36.5k  [r0603]  46.57 33.7 270 bottom
R68  46.4k  [r0603]  80.8 16.5 180 bottom
R72  75k  [r0603]  73.6 28.5 270 bottom
R77  49.9k  [R0603]  65.86 26.23 270 bottom
R78  49.9k  [R0603]  71.8 28.5 270 bottom
R79  68k  [r0603]  69.78 41.76 0 bottom
R80  46.4k  [r0603]  69.1 20.3 180 bottom
R81  4.22k  [r0805_new]  73.4 21.1 0 bottom
R82  4.7k  [R0603]  74.7 44.9 90 bottom
R83  100k  [R0603]  87.34 40 0 bottom
R84  100k  [R0603]  67 43.1 90 bottom
R85  4.7k  [R0603]  54.2 45.97 90 bottom
R86  10k  [R0603]  53.2 38.8 270 bottom
R87  68k  [r0603]  54.9 38.8 90 bottom
R88  49.9k  [R0603]  54.3 27.5 270 bottom
R89  75k  [r0603]  52.6 27.5 270 bottom
R90  49.9k  [R0603]  46.6 30.3 90 bottom
R91  510  [r0805_new]  82.3 13.1 90 bottom
R92  68k  [r0603]  36 41 270 top
R93  36.5k  [r0603]  34 41 90 top
RFBB1  10k  [0805 dany2]  30.8 41.4 270 top
RFBT1  73.2k  [0603 0.5x0.8]  27.5 43.62 270 top
RMODE1  30.1k  [1206r aditome]  28.66 48.02 180 top
RPG1  30.1k  [1206R aditome]  45.1 46.7 90 top
RSHUNT  WSLP25122L500FEA  [wslp25122l000fea bun]  68.5 15.3 270 bottom
RTRIP1  7.32k  [rtrip]  33.62 48.55 180 top
SERVOSUPPLY  switch  [new connector]  5.04 10.54 270 top
TP1  -  [test-point-0.5mm]  59.3 47.52 180 top
TP2  -  [Test-Point-0.5mm]  25.76 35.96 0 top
TP21  -  [test-point-0.5mm]  27.72 58.68 0 top
TP22  -  [test-point-0.5mm]  30.4 44.55 0 top
TP23  -  [Test-Point-0.5mm]  28.98 42.77 90 top
TP24  -  [test-point-0.5mm]  40.79 50.25 270 top
TP25  -  [test-point-0.5mm]  36.79 38.48 0 top
TP41  -  [test-point-0.5mm]  64.61 18.06 180 bottom
TP43  -  [Test-Point-0.5mm]  61.03 4.18 180 bottom
TP45  -  [Test-Point-0.5mm]  83.4 18.6 180 bottom
TP46  -  [Test-Point-0.5mm]  68.73 21.77 180 bottom
TP65  -  [test-point-0.5mm]  48.17 14.12 0 top
TP66  -  [test-point-0.5mm]  50.2 14.12 270 top
TP67  -  [Test-Point-0.5mm]  34.54 13.67 0 top
TP68  -  [Test-Point-0.5mm]  40.62 14.67 0 top
TP69  -  [Test-Point-0.5mm]  40.5 13.07 0 top
TP70  -  [test-point-0.5mm]  47.01 19.28 270 top
TP71  -  [test-point-0.5mm]  33.13 26.87 0 top
U13  LT1490IS8#PBF  [so-8_l4.9-w3.9-p1.27-ls5.9-bl]  70.8 34.1 90 bottom
U16  LT1490IS8#PBF  [so-8_l4.9-w3.9-p1.27-ls5.9-bl]  52 33.3 90 bottom
U17  NCP715SN50T1G  [tsop-5_l3.0-w1.5-p0.95-bl]  72.76 25.16 90 bottom
U18  NCP715SN50T1G  [tsop-5_l3.0-w1.5-p0.95-bl]  52.7 23.3 0 bottom
U19  DMPH3010LK3-13  [PG-TO252-3_L6.3-W6.5-P4.57-LS10.0-BR-CW]  80.11 26.79 270 bottom
U20  DMPH3010LK3-13  [PG-TO252-3_L6.3-W6.5-P4.57-LS10.0-BR-CW]  60 26.6 270 bottom
VARSUPPLY  switch  [new connector]  5.04 25.78 270 top
VBAT_I_CURRENT  switch  [new connector]  5.04 33.4 270 top

## Footprints (pads in the part's own frame, mm; a bottom-side part is the same pattern mirrored in y, then rotated)
0603 0.5x0.8
  rect 0.5x0.8 smd: 1(-0.753,0) 2(0.753,0)
0805 dany2
  rect 1.35x1.377 smd: 1(-1,0) 2(1.15,0)
1206r aditome
  rect 0.9x1.5 smd: 1(-1.55,0) 2(1.55,0)
1206R aditome
  rect 0.9x1.5 smd: 1(-1.7,0) 2(1.4,0)
c9
  rect 0.8x0.9 smd: 1(-0.8,0) 2(0.9,0)
c0603
  rect 0.8x0.9 smd: 1(-0.7,0) 2(0.7,0)
c0805
  rect 1.41x1.35 smd: 1(-1.03,0) 2(1.03,0)
c1210
  rect 1.635x2.7 smd: 1(-1.518,0) 2(1.518,0)
capae1030x1050n
  rect 4.3x2.05 smd: 1(-4.2,0) 2(4.2,0)
cbst2
  rect 0.8x0.9 smd: 1(-0.7,0) 2(0.9,0)
Cbst2
  rect 0.8x0.9 smd: 1(-0.7,0) 2(0.9,0)
cin1 aditome
  rect 1.2x1.8 smd: 1(-1.7,0) 2(1.5,0)
dfn1006-2l-rd
  rect 0.5x0.6 smd: 1(-0.4,0) 2(0.4,0)
dr127-3r3-r (l2)
  rect 3.85x5.5 smd: 1(-4.975,0) 2(4.975,0)
fusc6127x294n
  rect 2.02x2.95 smd: 1(-2.5,0) 2(2.5,0)
ihlp4040dzerr47m11
  rect 3.175x4.953 smd: 1(-4.508,0.064) 2(4.508,0.064)
ina180a2qdbvrq1
  rect 0.532x1.07 smd: 1(-0.95,-1.135) 2(0,-1.135) 3(0.95,-1.135) 4(0.95,1.135) 5(-0.95,1.135)
ledgreen
  rect 1.3x0.5 smd: 1(0.55,0)
  rect 0.87x0.5 smd: 2(-0.765,0)
M2021BB1W01
  oval 3x3.5 hole 1.3x3: 1(0.889,-4.572) 2(5.589,-4.572) 3(0.889,0.228) 4(5.589,0.228)
new connector
  rect 1.8x1.8 hole 1.2: 1(-0.395,0)
  round 1.8 hole 1.2: 2(-0.395,5.08) 3(3.415,0) 4(3.415,5.08)
Pad_e107
  round 4.5 hole 3: 22(0,0)
Pad_e146
  round 6 hole 4: 22(0,0)
Pad_e147
  round 6 hole 4: 22(0,0)
Pad_e148
  round 4.5 hole 3: 22(0,0)
Pad_e149
  round 4.5 hole 3: 22(0,0)
Pad_e151
  round 4.5 hole 3: 22(0,0)
PG-TO252-3_L6.3-W6.5-P4.57-LS10.0-BR-CW
  rect 3x1.6 smd: 1(3.614,-2.3) 3(3.614,2.3)
  rect 6.5x6 smd: 2(-3.614,0.001)
r35
  rect 0.5x1 smd: 1(-0.8,0) 2(0.8,0)
R35
  rect 0.5x1 smd: 1(-0.847,0) 2(0.753,0)
r0603
  rect 0.806x0.864 smd: 1(-0.753,0) 2(0.753,0)
R0603
  rect 0.806x0.864 smd: 1(-0.753,0) 2(0.753,0)
R0805_NEW
  rect 1.133x1.377 smd: 1(-0.966,0) 2(0.966,0)
r0805_new
  rect 1.133x1.377 smd: 1(-0.966,0) 2(0.966,0)
rtrip
  rect 1.1x1.25 smd: 1(-0.753,0) 2(0.997,0)
so-8_l4.9-w3.9-p1.27-ls5.9-bl
  oval 0.574x1.888 smd: 1(-1.905,-2.699) 2(-0.635,-2.699) 3(0.635,-2.699) 4(1.905,-2.699) 5(1.905,2.699) 6(0.635,2.699) 7(-0.635,2.699) 8(-1.905,2.699)
sot-323-3_l2.2-w1.3-p1.30-ls2.2-br
  rect 0.9x0.7 smd: 1(1.016,-0.66) 2(1.016,0.66) 3(-1.016,0)
szbzx84c18et1g
  rect 0.61x0.976 smd: 1(-0.95,-0.938) 2(0.95,-0.938)
  rect 0.522x0.976 smd: 3(0,0.938)
test-point-0.5mm
  round 0.5 smd: 1(0,0)
Test-Point-0.5mm
  round 0.5 smd: 1(0,0)
TPS548B28RWWR
  rect 0.7x0.3 smd: 1(0,9.906) 9(0,6.506) 11(2.7,6.506) 19(2.7,9.906)
  rect 0.7x0.2 smd: 2(0,9.406) 3(0,9.006) 4(0,8.606) 5(0,8.206) 6(0,7.806) 7(0,7.406) 8(0,7.006) 12(2.7,7.006) 13(2.7,7.406) 14(2.7,7.806) 15(2.7,8.206) 16(2.7,8.606) 17(2.7,9.006) 18(2.7,9.406)
  rect 0.3x1.9 smd: 10(1.05,6.956) 20(1.65,9.456) 21(1.05,9.456)
TPS61288RQQR
  rect 0.575x0.25 smd: 1(-1.413,0.875) 7(1.413,0.875)
  rect 0.55x0.25 smd: 2(-1.425,0.375) 6(1.425,0.375)
  rect 1.25x0.4 smd: 3(-1.075,-0.2) 5(1.075,-0.2)
  rect 0.4x1 smd: 4(0,-0.25)
  rect 0.25x0.55 smd: 8(0.75,1.175) 9(0.25,1.175) 10(-0.25,1.175) 11(-0.75,1.175)
  rect 0.225x0.45 smd: 12(-1.237,1.225) 15(1.237,1.225)
  rect 0.4x1.05 smd: 13(-0.65,-0.925) 14(0.65,-0.925)
tsop-5_l3.0-w1.5-p0.95-bl
  rect 0.7x1 smd: 1(-0.95,-1.2) 2(0,-1.2) 3(0.95,-1.2) 4(0.95,1.2) 5(-0.95,1.2)
wslp25122l000fea bun
  rect 1.6x3.68 smd: 1(-2.875,0) 2(2.875,0)

## Nets
As in the schematic, except:
GND: C1.2 C2.2 C5.2 C6.2 Ccomp2.1 Ccomp3.1 CIC.2 CIN1.2 Cin2.1 CINX1.2 Cinx2.2 CON1.3 CON1.4 CON2.3 CON2.4 CON3.3 CON3.4 CON4.3 CON4.4 COUT1.2 Cout2.1 CServo.1 CSS1.2 CVCC1.2 Cvcc2.1 F1.2 F2.2 IC1.2 IC1.6 IC1.11 IC1.12 IC1.13 IC1.14 IC1.15 IC1.16 IC1.17 IC1.18 IC2.3 IC2.10 IC2.13 IC3.2 LED1.1 NOREF#5.22 Q17.2 Q21.2 R2.2 R27.2 R35.2 R55.1 R67.1 R72.2 R79.1 R81.2 R87.1 R89.2 R93.1 RFBB1.2 RMODE1.2 RTRIP1.2 SERVOSUPPLY.3 SERVOSUPPLY.4 U13.4 U16.4 U17.1 U17.4 U17.5 U18.1 U18.4 U18.5 VARSUPPLY.3 VARSUPPLY.4
VBATT1: C1.1 H1.3 R77.2 U17.2
VBATT2: C5.1 H1.1 R90.1 U18.2
OUT_BATT: CIN1.1 CINX1.1 IC1.10 IC1.21 IC3.4 NOREF#4.22 R1.2 R92.2 RSHUNT.2 TP1.1 TP25.1
OUT_BATT1: D15.1 H1.4 NOREF.22 Q16.3 R83.2
OUT_BATT2: D17.1 H1.2 NOREF#6.22 Q20.3 R84.2
$2N28: F1.1 NOREF#3.22
$2N30: F2.1 NOREF#2.22

Pads without a net: D7 2; D8 2

## Via types
v1: diameter 0.5, hole 0.3, Top Layer to Bottom Layer, 67 vias
v2: diameter 0.8, hole 0.5, Top Layer to Bottom Layer, 32 vias

## Routing (per net, layer and track width the routed paths; a pad name or vN(x,y) marks a point on that pad's centre or on a via; arc(x,y) is an arc through that point)
+5V: length 70.6
  Top Layer w0.254: Cin2.2 46.33,17.65 46.04,17.37 IC2.15
  Top Layer w0.3: IC2.6 46.23,16.64 ; 46.23,16.64 46.83,16.64 47.08,16.89 47.08,17.58 47.07,17.59 ; 46.23,16.64 IC2.7
  Top Layer w0.5: v1(74.56,10.69) 74.56,12.36 74.48,12.44 74.55,12.5 IC3.5
  Bottom Layer w0.5: v1(74.56,10.69) 74.76,10.49 74.76,2.1 73.62,0.96 60.11,0.96 54.37,6.71 40.66,6.71 36.51,10.86 33.56,10.86 v1(28.1,16.32)
  vias: v2(23.83,44.88) v2(23.81,43.73) v2(23.97,58.17) v2(23.97,57.15) v2(24.81,44.88) v2(24.84,43.73) v2(25.05,58.17) v2(25.05,57.15) v2(25.79,44.88) v2(25.87,43.73) v2(26.13,58.17) v2(26.13,57.15) v2(27.02,33.27) v2(27.02,32) v2(27.56,10.56) v2(28.35,33.27) v2(28.35,32) v2(28.52,10.56) v2(29.51,10.55) v2(29.69,33.27) v2(29.69,32)
+VCC2: length 12.5
  Bottom Layer w0.5: 71.74,27.69 70.83,27.69 69.9,28.62 69.9,30.8 71.29,32.19 U13.8 ; 71.74,27.69 71.74,26.29 U17.3 70.55,26.11 70.3,26.36 C2.1 ; 71.74,27.69 R78.2
+VCC3: length 12.3
  Bottom Layer w0.3: R88.1 54.37,28.32 55.09,28.32 55.52,27.89 55.52,24.5 U18.3
  Bottom Layer w0.5: R88.1 54.3,29.31 54.83,29.84 55.59,29.84 56.1,30.35 56.1,31.11 55.85,31.37 54.72,31.37 U16.8
GND: length 16.7
  Top Layer w0.2: 37.47,45.86 36.14,45.86 v1(35.78,45.5) ; 35.9,48.55 35.9,48.37 36.81,47.46 37.6,47.46
  Top Layer w0.254: IC2.13 44.16,12.7 44.16,12.7 ; 40.17,44.56 42.14,44.56 ; IC2.10 44.56,16.58 44.18,16.2 44.18,15.58 IC2.3 43.01,15.58 42.8,15.37 42.8,13.56 43.15,13.21 43.15,12.95
  Top Layer w0.3: 40.17,44.56 40.17,47.46
  vias: v1(22.65,63.41) v1(24.75,63.41) v1(26.85,63.41) v1(28.94,63.41) v1(31.04,63.41) v1(34.19,1.36) v1(35.9,48.55) v1(36.04,12.95) v1(36.29,1.36) v1(38.38,1.36) v1(38.71,18.78) v1(40.48,1.36) v1(42.58,1.36) v1(44.68,1.36) v1(45.12,63.35) v1(46.77,1.36) v1(47.22,63.35) v1(47.34,7.87) v1(48.87,1.36) v1(50.97,1.36) v1(51.28,16.13) v1(51.79,15.62) v1(52.36,18.44) v1(52.93,18.03) v1(53.06,1.36) v1(53.43,17.53) v1(55.16,1.36) v1(57.26,1.36) v1(84.37,1.02) v1(86.46,1.02) v1(88.54,1.02) v1(92.84,48.27) v1(92.84,46.19) v1(92.84,44.1) v1(92.84,42.02) v1(92.84,39.93) v1(92.84,37.85) v1(92.84,35.76) v1(92.84,33.68) v1(92.84,31.59) v1(92.84,29.51) v1(92.84,27.43) v1(92.84,25.34) v1(92.84,23.26) v1(92.84,21.17) v1(92.84,19.09) v1(92.84,17) v1(92.84,14.92) v1(92.84,12.83) v1(92.84,10.75) v1(92.84,8.66) v1(92.84,6.58) v1(92.84,4.49) v1(92.84,2.41) v2(50.03,22.98) v2(50.12,24.12) v2(50.56,28.2) v2(67.28,29.7) v2(67.76,28.86) v2(68.42,28.26) v2(75.34,26.11)
VBATT1: length 30.4
  Top Layer w0.5: 72.29,3.31 69.52,6.09 v1(69.52,23.17)
  Bottom Layer w0.5: R77.2 65.86,23.73 66.42,23.17 v1(69.52,23.17) 69.52,24.56 C1.1 70.18,24.56 70.78,25.16 U17.2
VBATT2: length 47.7
  Bottom Layer w0.3: R90.1 47.65,29.55 50.87,26.33 50.87,25.7 52,25.7 52.7,25 U18.2
  Bottom Layer w0.8: R90.1 46.6,22.3 60.78,8.12 72.29,8.12
VCC: length 5.2
  Top Layer w0.3: CVCC1.1 42.04,47.96 40.17,47.96
  Top Layer w0.5: CVCC1.1 43.04,47.9 43.53,48.39 45.09,48.39 45.1,48.4
VCCBOOST: length 3.6
  Top Layer w0.3: Cvcc2.2 42.24,17.38 42.64,17.78 43.71,17.78 44.06,17.43 IC2.11
ADC1: length 18.8
  Top Layer w0.5: 27.96,35.95 21.83,35.95 21.1,35.22 11.98,35.22 ; 27.96,35.95 R2.1 ; 27.96,35.95 30.31,35.95 R1.1
BOOT: length 3.4
  Top Layer w0.3: 37.47,47.96 36.93,47.96 36.46,48.44 36.46,49.69 36.64,49.88 37.26,49.88 37.32,49.94
BST: length 2.8
  Top Layer w0.254: IC2.8 45.56,19.06 45.31,19.31 Cbst2.2
COMP: length 5.6
  Top Layer w0.254: IC2.2 42.41,16.15 41.75,15.49 41.75,14.48 R34.2
  Top Layer w0.3: Ccomp3.2 39.37,14.98 40.31,14.98 40.85,14.43 R34.2
EN: length 7.2
  Top Layer w0.2: 37.47,45.06 36.76,45.06 34,42.3 R93.2
  Top Layer w0.254: R93.2 R92.1
FB: length 11.9
  Top Layer w0.2: 37.47,45.46 36.54,45.46 35.64,44.56 CFF1.2 34.79,43.83 33.36,42.4 RFBB1.1 30.43,42.77 TP23.1 27.78,42.77 27.68,42.87 RFBT1.2
FB_1: length 24.4
  Top Layer w0.3: IC2.1 43.37,16.68 42.21,16.68 41.68,16.16 R35.1
  Top Layer w0.5: R35.1 35.76,14.8 35.18,14.22 35.09,14.22 TP67.1 34.51,13.65 34.51,12.37 35.56,11.33 46.31,11.33
ISHUNT: length 95.6
  Top Layer w0.5: v1(62.45,2.79) 64.29,0.96 73.57,0.96 74.76,2.15 74.76,9.46 75.79,10.49 75.79,15.88 75.41,16.25 74.57,16.25
  Bottom Layer w0.3: 61.07,4.18 TP43.1
  Bottom Layer w0.5: v1(62.45,2.79) 35.72,29.53 26.32,29.53 20.3,35.55 15.25,35.55 11.28,31.58 11.22,31.58
MODE: length 7.8
  Top Layer w0.2: 37.47,46.66 36.39,46.66 35.7,47.36 31.9,47.36 31.24,48.02 RMODE1.1
OUT_BATT: length 15.4
  Top Layer w0.3: 38.52,47.51 38.52,42.37 CINX1.1
  Top Layer w0.5: v1(71.32,14) 72.64,14 IC3.4 ; R1.2 34.01,36.08 34.9,36.97 36.7,36.97
  Bottom Layer w0.5: RSHUNT.2 68.5,13.41 69.08,14 v1(71.32,14)
  vias: v1(62.58,12.95) v1(62.58,12.06) v1(63.21,12.95) v1(63.34,12.06)
OUT_BATT1: length 54.9
  Bottom Layer w0.8: 76.99,3.31 86.54,3.31 88.1,4.87 R83.2 88.1,42.56 85.83,44.83 83.53,44.83
OUT_BATT2: length 44.4
  Top Layer w0.8: 65.25,47.62 v2(66.2,46.67) 76.99,35.88 76.99,8.12
  vias: v2(65.37,47.5)
PGOOD: length 10.8
  Top Layer w0.3: RPG1.1 45.1,44.2 v1(44.5,43.6) ; 37.47,44.56 37.05,44.56 36.79,44.31 36.79,43.62
  Bottom Layer w0.3: v1(44.5,43.6) v1(36.8,43.6)
SS_REFIN: length 3
  Top Layer w0.2: 37.47,46.26 34.65,46.26 34.53,46.38
SW: length 1.6
  Top Layer w0.254: 39.12,47.51 39.12,49.1
SW_1: length 14
  Top Layer w0.254: IC2.9 45.06,17.65 44.55,18.16 43.66,18.16 43.4,18.42 43.4,19.24 Cbst2.1
  Top Layer w0.3: 39.34,25.63 39.34,21.75 41.78,19.31 Cbst2.1 ; IC2.9 45.06,16.53 44.81,16.28 IC2.4
TRIP: length 3.6
  Top Layer w0.2: 37.47,47.06 36.59,47.06 35.11,48.55 34.48,48.55 34.46,48.53
UBATT: length 21.3
  Top Layer w0.5: v1(71.26,16.28) 72.64,16.28 IC3.3
  Bottom Layer w0.5: 76.17,17.91 77.57,16.5 R68.2 80.05,14.85 80.8,14.1 82.27,14.1 R91.2 ; v1(71.26,16.28) 69.16,16.28 68.5,16.94 RSHUNT.1 ; R80.2 67.26,20.3 67.02,20.06 D8.3 65.6,18.29 ; 79.86,19.4 77.56,19.4
VOUT1: length 10.3
  Top Layer w0.254: IC2.5 46.87,15.58 47.08,15.37 47.08,14.38 46.24,13.54
  Top Layer w0.3: IC2.14 45.46,14.1 45.71,13.84 45.94,13.84 46.41,13.38 R33.2
  Top Layer w1: Cout2.2 51.02,12.7 51.91,11.81 v2(51.91,11.68) v2(51.91,10.67)
$1N1788: length 13.8
  Bottom Layer w0.4: D8.1 64.65,21.14 64.84,20.95 67.06,20.95 67.9,21.8 68.7,21.8 TP46.1 69.3,21.77 69.85,21.22 R80.1
  Bottom Layer w0.5: R81.1 71.49,21.1 70.69,20.3 R80.1
  Bottom Layer w0.6: U20.1 62.43,23.11 64.24,23.11 64.65,22.7 D8.1
$1N1798: length 12.6
  Bottom Layer w0.5: R68.1 82.76,16.5 83.4,17.14 TP45.1 83.4,19.56 82.61,20.35 D7.1 81.74,20.94 82.11,21.31 82.11,22.87 U19.1
  Bottom Layer w0.8: R27.1 85.19,23.17 U19.1
$1N2337: length 19.3
  Bottom Layer w0.5: R83.1 86.59,41.21 85.98,41.82 81.63,41.82 79.78,43.67 79.78,44.38 79.1,45.06 77.7,45.06 ; 77.7,45.06 77.7,44.78 Q16.1 77.68,45.12 77.14,45.66 R82.2 ; 77.7,45.06 77.7,46.78 78.15,47.22 D15.2
$1N2412: length 1.7
  Bottom Layer w0.5: Q17.3 74.68,44.16 R82.1
$1N2516: length 4
  Bottom Layer w0.5: 72.58,41.61 72.43,41.76 R79.2 70.53,42.41 70.96,42.84 Q17.1
$1N20674: length 10
  Bottom Layer w0.5: R77.1 65.86,34.72 65.87,34.73 U13.3
$1N20931: length 7.6
  Bottom Layer w0.3: 69.38,38.04 69.38,36.8 69.82,36.37 69.82,33.77 69.52,33.47 U13.2
  Bottom Layer w0.5: U13.1 U13.2
$1N20946: length 7.3
  Bottom Layer w0.3: U13.5 71.73,36 70.96,36.78 70.96,37.82 70.98,37.8 ; 70.96,38.02 70.96,38.64 70.72,38.88 69.64,38.88 69.33,39.19 R49.1
  Bottom Layer w0.5: 70.96,38.02 70.96,37.82
$1N20962: length 14.5
  Bottom Layer w0.3: R32.1 74.05,40.11 75.15,39.01 75.15,35.89 74.66,35.4 72.32,35.4 71.85,34.93 71.85,33.92 72.31,33.47 U13.7
  Bottom Layer w0.5: R32.1 72.03,40.11 71.78,39.86 R49.2
$1N21052: length 9.9
  Bottom Layer w0.5: U13.6 74.66,34.73 75.16,34.23 75.16,29.78 74.63,29.25 R72.1 R78.1
$1N27792: length 18.5
  Bottom Layer w0.5: R85.2 54.2,47.38 54.7,47.88 56.74,47.88 57.7,46.92 Q20.1 58.99,44.61 59.53,44.07 59.53,42.55 60.17,41.91 63.72,41.91 64.02,42.21 66.92,42.21 67,42.13
$1N27793: length 2
  Bottom Layer w0.5: Q21.3 54.2,45.22 R85.1
$1N27799: length 3.3
  Bottom Layer w0.5: Q21.1 54.9,41.14 R87.2 R86.1
$1N27802: length 3.1
  Bottom Layer w0.5: 49.52,29.64 49.52,31.18 U16.1 U16.2
$1N27807: length 12.6
  Bottom Layer w0.3: U16.5 54.69,35.2 ; 51.12,29.64 51.12,30.68 51.94,31.5 51.94,35.2
  Bottom Layer w0.5: R64.1 49.65,36.92 50.02,36.56 50.68,36.56 52.03,35.2 U16.5
$1N27811: length 11
  Bottom Layer w0.3: 53.05,37.9 R86.2
  Bottom Layer w0.5: R64.2 53.26,37.9 53.26,37.1 53.76,36.6 55.4,36.6 56.2,35.8 56.2,32.99 55.87,32.67 U16.7
$1N27822: length 4.9
  Bottom Layer w0.3: 46.6,32.85 46.7,32.95
  Bottom Layer w0.5: 46.7,32.95 47.22,32.95 48.21,33.94 U16.3 ; R90.2 46.6,32.85
$1N32332: length 9.8
  Bottom Layer w0.3: R88.2 52.79,28.25 R89.1
  Bottom Layer w0.5: U16.6 53.14,33.94 52.6,33.39 R89.1
$1N40141: length 2.9
  Bottom Layer w0.5: 85.06,12.03 84.92,11.9 82.54,11.9 R91.1
$3N2936: length 2.8
  Top Layer w0.3: 39.02,13.22 40.4,13.22 40.69,12.93 R34.1

## Copper pours and planes (outline as drawn; the poured copper is in the pictures)
+5V on Top Layer: 27.4,31.62 27.4,33.68 28.16,34.04 46.67,34.04 48.4,32.3 48.4,27.86 47.08,26.54 45.05,26.54 44.54,27.05 44.54,30.23 43.66,31.11 28.17,31.11
+5V on Top Layer: 15.83,43.61 18.7,46.48 20.22,46.48 21.87,44.83 21.87,43.56 20.12,42.09 1.99,42.09 1.99,43.61
+5V on Top Layer: 1.8,58.57 2.16,58.93 26.84,58.93 27.39,58.38 27.39,56.63 26.76,56.01 23.06,56.01 21.66,57.4 2,57.4 1.8,57.71
+5V on Top Layer: 44.61,27.41 48.23,27.18 48.39,23.56 49.11,21.88 49.11,16.34 48.89,16.03 48.89,15.35 48.68,15.15 47.91,15.15 47.71,15.35 47.71,18.13 44.61,21.23
+5V on Top Layer: 1.65,20.58 2.23,20.95 26,20.95 27.4,22.35 27.4,18.03 27.27,17.91 26,19.17 2.28,19.17 1.65,19.52
+5V on Top Layer: 1.76,51.43 18.94,51.39 20.54,49.78 20.54,46.86 21.81,45.59 26,45.59 26.51,45.09 26.51,43.44 26.13,43.05 21.31,43.05 18.26,46.1 18.26,48.89 17.54,49.82 2.32,49.82 1.66,50.28
+5V on Top Layer: 33.27,45.06 33.47,44.85 33.47,44.31 33.28,44.11 26.92,44.11 26.4,43.73 26.4,45.2 26.65,45.06
+5V on Top Layer: 26.13,34.04 31.21,34.04 31.84,33.4 31.84,31.88 30.18,30.21 30.18,10.23 29.71,9.66 27.53,9.66 26.64,10.15 26.64,30.21 25.49,31.75
+5V on Top Layer: 23.02,58.52 24.16,59.66 31.36,59.66 32.2,58.81 32.2,53.71 23.47,53.71 23.02,54.18
+5V on Bottom Layer: 1.66,12.78 2.2,13.32 17.35,13.32 22.65,7.85 26.81,6.75 26.81,5.76 22.46,5.76 16.58,11.7 2.08,11.7 1.78,12 1.78,12.66
+5V on Bottom Layer: 28.22,11.46 29.54,11.46 30.02,10.98 30.02,7.73 27.89,5.61 24.05,5.61 24.05,7.41 26.75,11.48 28.2,11.48
+5V on Bottom Layer: 23.52,58.87 26.58,58.87 26.95,58.42 26.95,34.87 27.78,34.04 30.22,34.04 30.57,33.78 30.57,31.28 30.14,31.1 26.02,31.1 23.08,34.04 23.08,58.37
GND on Top Layer: -16.62,69.9 101.64,69.9 101.64,-8.58 -16.62,-8.58
GND on Bottom Layer: 53.99,40.73 53.96,40.66 53.89,40.63 53.19,40.63 53.12,40.66 53.09,40.73 53.09,41.63 53.12,41.71 53.19,41.74 53.89,41.74 53.96,41.71 53.99,41.63
GND on Bottom Layer: 53.19,40.63 53.12,40.66 53.09,40.73 53.09,41.63 53.12,41.71 53.19,41.74 53.89,41.74 53.96,41.71 53.99,41.63 53.99,40.73 53.96,40.66 53.89,40.63
GND on Bottom Layer: 53.99,40.73 53.96,40.66 53.89,40.63 53.19,40.63 53.12,40.66 53.09,40.73 53.09,41.63 53.12,41.71 53.19,41.74 53.89,41.74 53.96,41.71 53.99,41.63
GND on Bottom Layer: 53.99,40.73 53.96,40.66 53.89,40.63 53.19,40.63 53.12,40.66 53.09,40.73 53.09,41.63 53.12,41.71 53.19,41.74 53.89,41.74 53.96,41.71 53.99,41.63
GND on Bottom Layer: -18.9,73.44 100.86,73.44 100.86,-16.5 -18.9,-16.5
ADC1 on Top Layer: 1.78,35.88 12.46,35.88 12.88,35.46 12.88,34.92 12.58,34.62 2.08,34.62 1.78,34.92
ISHUNT on Bottom Layer: 2.24,32.34 11.7,32.34 12.02,31.96 12.02,30.83 11.3,30.64 2.39,30.59 1.9,31.08 1.9,32.04
OUT_BATT on Top Layer: 64.25,12.28 64.25,36.44 58.42,36.38 61.28,32.89 61.38,12.21 62.24,11.35 63.32,11.35
OUT_BATT on Top Layer: 64.39,59.8 64.39,35.15 48.72,34.8 37.2,34.8 35.48,36.52 35.48,40.41 35.74,40.67 36.72,40.67 38.18,41.57 38.18,42.36 38.32,42.55 38.95,42.54 39.03,42.46 39.03,39.1 37.86,38.39 37.87,37.75 38.39,37.41 55.67,37.4 58.45,40.75 58.45,59.8
OUT_BATT on Bottom Layer: 61.92,11.92 62.31,11.53 68.11,11.53 68.81,11.91 68.81,12.51 67.82,13.5 62.44,13.5 61.92,13.08
OUT_BATT1 on Bottom Layer: 78.9,47.8 78.9,51.44 80.52,53.18 80.52,57.95 85.14,57.95 85.14,44.89 83.9,43.65 81.33,43.65 81.33,47.17 80.7,47.8
OUT_BATT2 on Bottom Layer: 67.16,58.02 71.75,58.02 71.75,52.92 67.76,47.35 67.76,43.48 66.32,43.51 64.96,42.92 61.81,42.89 61.4,43.3 61.4,46.86 67.16,53.69
SW on Top Layer: 38.78,49.03 39.69,49.04 40.18,49.52 41.06,49.52 42.37,50.83 42.37,57.58 41.54,58.54 38.48,58.54 38.24,58.25 38.31,50.41
SW_1 on Top Layer: 34.34,29.93 39.76,29.93 40.63,29.05 40.63,24.82 40.08,24.13 34.22,24.13 32.77,25.58 32.77,28.36
UBATT on Bottom Layer: 56.98,23.8 56.98,21.45 60.75,17.35 76.65,17.35 78.77,19.47 78.77,24.8 76.9,24.8 76.26,24.16 76.26,20.48 74.88,19.1 62.2,19.1 59.15,22.15 59.15,23.32 58.48,23.8
VOUT1 on Top Layer: 45.75,13.46 47.07,13.46 47.47,14.1 47.78,14.47 50.44,14.47 50.62,14.29 50.62,12.3 50.29,11.98 47.65,11.98 47.17,12.48 45.81,12.48 45.71,12.58 45.71,13.42
VOUT1 on Bottom Layer: 52.29,10.46 52,10.16 39.85,10.16 23.18,26.83 1.96,26.83 1.65,26.97 1.65,28.04 3.22,28.49 24.44,28.49 40.73,12.19 52.04,12.19 52.29,11.94
$1N2164 on Bottom Layer: 76.9,40.56 83.24,40.56 83.24,27.54 76.9,27.54
$1N27791 on Bottom Layer: 57.2,38.4 62.7,38.4 63.1,38 63.1,30.7 63,30.6 57.1,30.6 57,30.5 57,38.2
$2N28 on Top Layer: 73.87,58.61 78.39,58.61 78.46,51.58 77.58,50.7 74.44,50.7 73.87,51.78
$2N30 on Top Layer: 87.17,58.66 91.75,58.66 91.75,51.85 90.64,50.73 88.41,50.73 87.17,51.97

Small or netless copper shapes (teardrops, artwork), in the pictures only: 83 on Top Layer, 118 on Bottom Layer

## Text on the board
Top Silkscreen Layer: I_Current | Vbat | Def. 12V | - | _ | + | Engine | Bat2 | Bat1 | BFMC POWER BOARD  V3
